# EAGLE design STM32-E407_Rev_A (EAGLE 4.16)
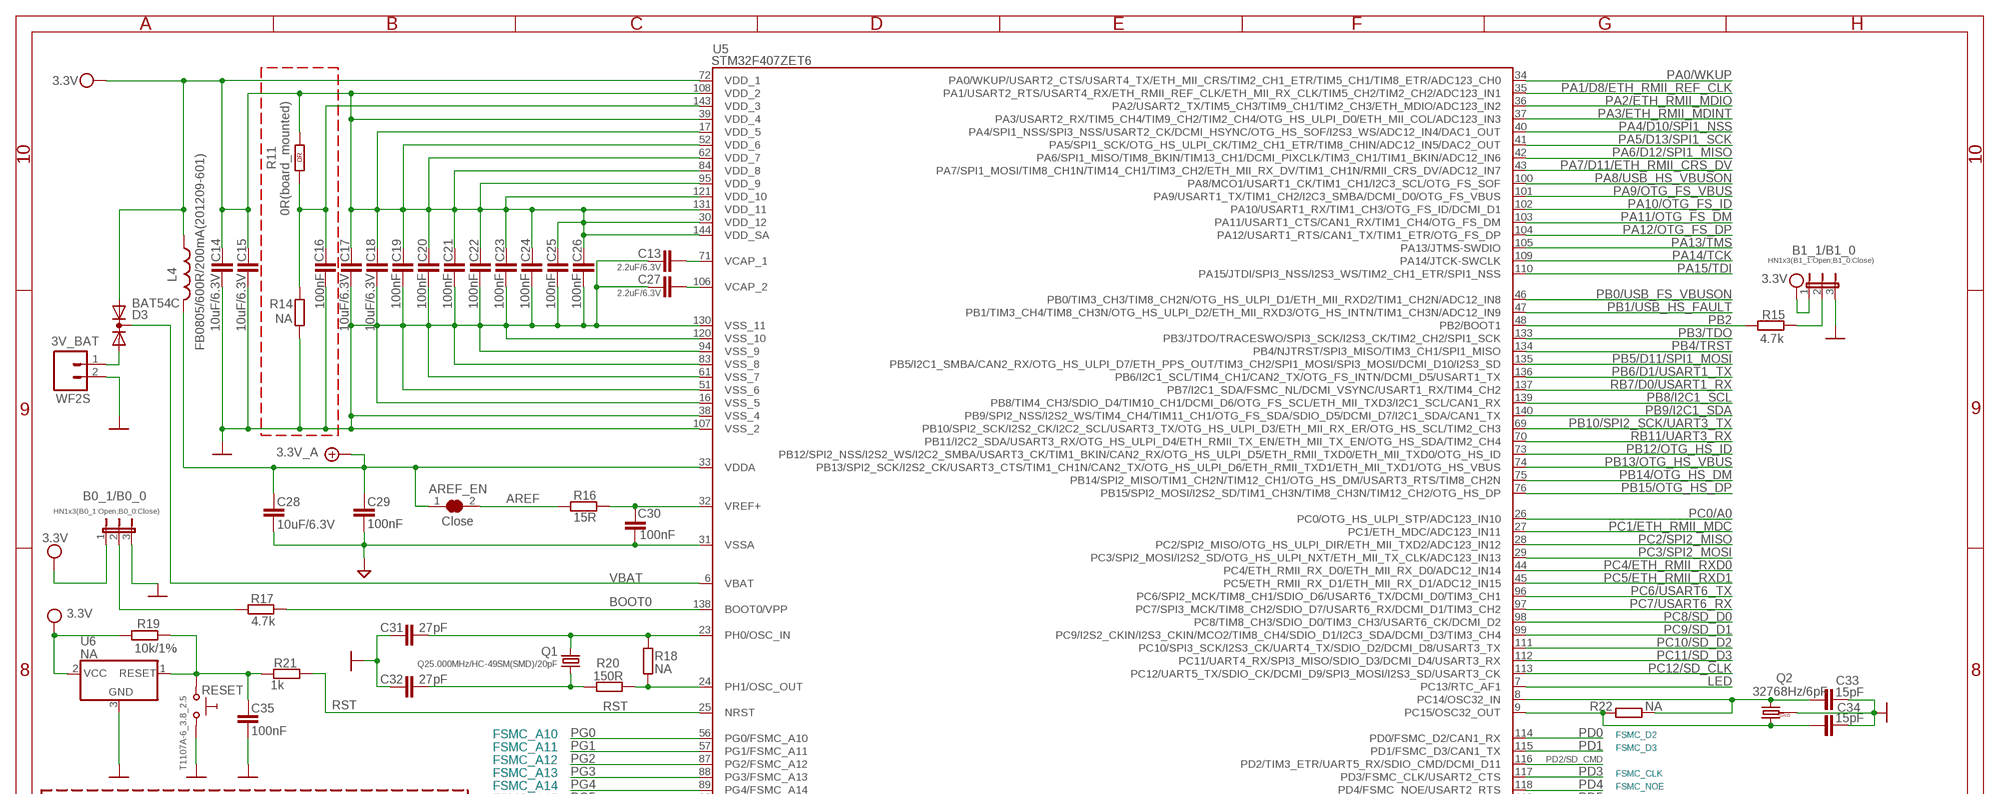
[diagram p0: schematic, sheet 1, part 1 of 2]
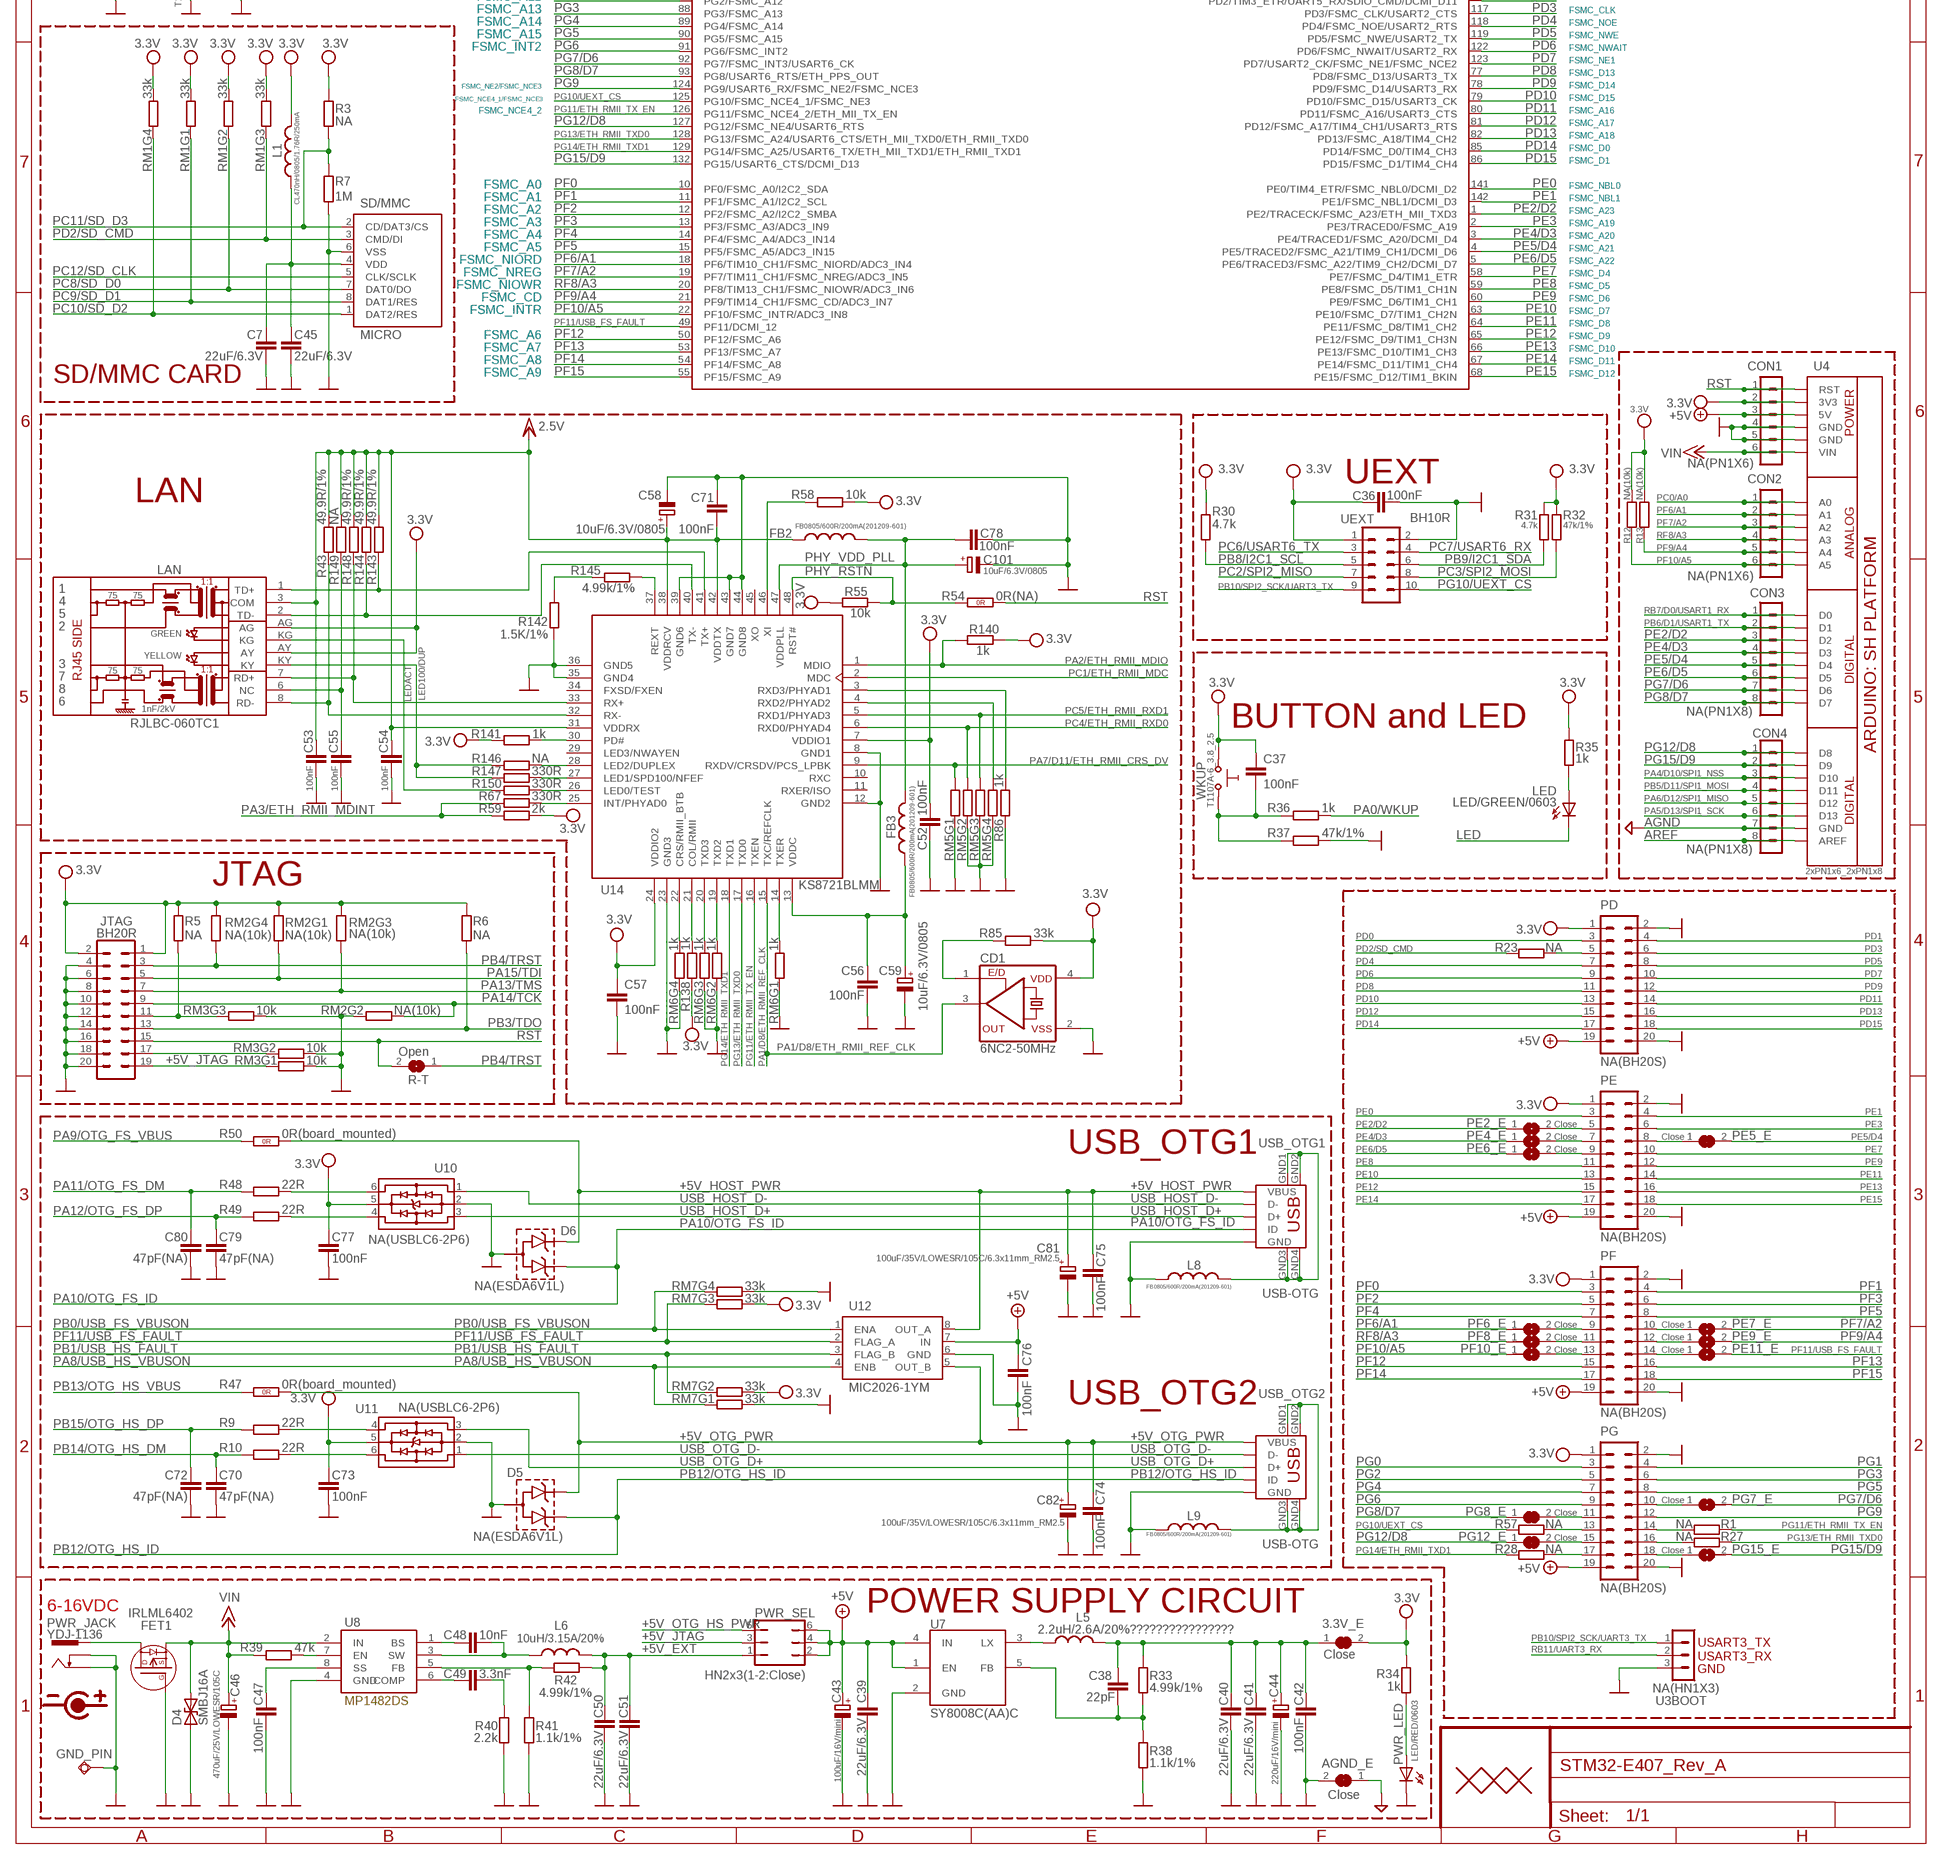
[diagram p1: schematic, sheet 1, part 2 of 2]

## Parts
3.3V_E  Close  SJSJ_1_SMALLER_CLOSE  [SJ_1_SMALLER_CLOSE]
3V_BAT  WF2S  CON2PV2-2.54MM  [CON2.54MM-2-0]
AGND_E  Close  SJSJ_1_SMALLER_CLOSE  [SJ_1_SMALLER_CLOSE]
AREF_EN  Close  SJSJ_1_SMALLER_CLOSE  [SJ_1_SMALLER_CLOSE]
B0_1/B0_0  HN1x3(B0_1:Open;B0_0:Close)  JP2E  [JP2]
B1_1/B1_0  HN1x3(B1_1:Open;B1_0:Close)  JP2E  [JP2]
C7  22uF/6.3V  C-EUC0805_5MIL_DWS  [C0805_5MIL_DWS]
C13  2.2uF/6.3V  C-EUC0603_DWS  [C0603_DWS]
C14  10uF/6.3V  C-EUC0603_DWS  [C0603_DWS]
C15  10uF/6.3V  C-EUC0603_DWS  [C0603_DWS]
C16  100nF  C-EUC0603_DWS  [C0603_DWS]
C17  10uF/6.3V  C-EUC0603_DWS  [C0603_DWS]
C18  10uF/6.3V  C-EUC0603_DWS  [C0603_DWS]
C19  100nF  C-EUC0603_DWS  [C0603_DWS]
C20  100nF  C-EUC0603_DWS  [C0603_DWS]
C21  100nF  C-EUC0603_DWS  [C0603_DWS]
C22  100nF  C-EUC0603_DWS  [C0603_DWS]
C23  100nF  C-EUC0603_DWS  [C0603_DWS]
C24  100nF  C-EUC0603_DWS  [C0603_DWS]
C25  100nF  C-EUC0603_DWS  [C0603_DWS]
C26  100nF  C-EUC0603_DWS  [C0603_DWS]
C27  2.2uF/6.3V  C-EUC0603_DWS  [C0603_DWS]
C28  10uF/6.3V  C-EUC0603_DWS  [C0603_DWS]
C29  100nF  C-EUC0603_DWS  [C0603_DWS]
C30  100nF  C-EUC0603_DWS  [C0603_DWS]
C31  27pF  C-EUC0603_DWS  [C0603_DWS]
C32  27pF  C-EUC0603_DWS  [C0603_DWS]
C33  15pF  C-EUC0603_DWS  [C0603_DWS]
C34  15pF  C-EUC0603_DWS  [C0603_DWS]
C35  100nF  C-EUC0603_DWS  [C0603_DWS]
C36  100nF  C-EUC0603_DWS  [C0603_DWS]
C37  100nF  C-EUC0603_DWS  [C0603_DWS]
C38  22pF  C-EUC0603_DWS  [C0603_DWS]
C39  22uF/6.3V  C-EUC0805_5MIL_DWS  [C0805_5MIL_DWS]
C40  22uF/6.3V  C-EUC0805_5MIL_DWS  [C0805_5MIL_DWS]
C41  22uF/6.3V  C-EUC0805_5MIL_DWS  [C0805_5MIL_DWS]
C42  100nF  C-EUC0603_DWS  [C0603_DWS]
C43  100uF/16V/mini  CPOL-EUE2.5-6  [E2,5-6]
C44  220uF/16V/mini  CPOL-EUE3.5-8  [E3,5-8]
C45  22uF/6.3V  C-EUC0805_5MIL_DWS  [C0805_5MIL_DWS]
C46  470uF/25V/LOWESR/105C  CPOL-EUE5-10.5  [E5-10,5]
C47  100nF  C-EUC0603_DWS  [C0603_DWS]
C48  10nF  C-EUC0603_DWS  [C0603_DWS]
C49  3.3nF  C-EUC0603_DWS  [C0603_DWS]
C50  22uF/6.3V  C-EUC0805_5MIL_DWS  [C0805_5MIL_DWS]
C51  22uF/6.3V  C-EUC0805_5MIL_DWS  [C0805_5MIL_DWS]
C52  100nF  C-EUC0603_DWS  [C0603_DWS]
C53  100nF  C-EUC0603_DWS  [C0603_DWS]
C54  100nF  C-EUC0603_DWS  [C0603_DWS]
C55  100nF  C-EUC0603_DWS  [C0603_DWS]
C56  100nF  C-EUC0603_DWS  [C0603_DWS]
C57  100nF  C-EUC0603_DWS  [C0603_DWS]
C58  10uF/6.3V/0805  CPOL-EUC0805_5MIL_DWS  [C0805_5MIL_DWS]
C59  10uF/6.3V/0805  CPOL-EUC0805_5MIL_DWS  [C0805_5MIL_DWS]
C70  47pF(NA)  C-EUC0603_DWS  [C0603_DWS]
C71  100nF  C-EUC0603_DWS  [C0603_DWS]
C72  47pF(NA)  C-EUC0603_DWS  [C0603_DWS]
C73  100nF  C-EUC0603_DWS  [C0603_DWS]
C74  100nF  C-EUC0603_DWS  [C0603_DWS]
C75  100nF  C-EUC0603_DWS  [C0603_DWS]
C76  100nF  C-EUC0603_DWS  [C0603_DWS]
C77  100nF  C-EUC0603_DWS  [C0603_DWS]
C78  100nF  C-EUC0603_DWS  [C0603_DWS]
C79  47pF(NA)  C-EUC0603_DWS  [C0603_DWS]
C80  47pF(NA)  C-EUC0603_DWS  [C0603_DWS]
C81  100uF/35V/LOWESR/105C/6.3x11mm_RM2.5  CPOL-EUE2.5-6.3  [E2,5-6,3]
C82  100uF/35V/LOWESR/105C/6.3x11mm_RM2.5  CPOL-EUE2.5-6.3  [E2,5-6,3]
C101  10uF/6.3V/0805  CPOL-EUC0805_5MIL_DWS  [C0805_5MIL_DWS]
CD1  6NC2-50MHz  6NC2_CLOCK_DRIVER  [7X5MM_CLOCK_DRIVER]
CON1  NA(PN1X6)  CON6PN1X6  [PN1X6]
CON2  NA(PN1X6)  CON6PN1X6  [PN1X6]
CON3  NA(PN1X8)  CON8PN1X8  [PN1X8]
CON4  NA(PN1X8)  CON8PN1X8  [PN1X8]
D3  BAT54C  DIODE_AC-CA_  [SOT23C]
D4  SMBJ16A  SMBJ15A  [DO214AA]
D5  NA(ESDA6V1L)  MMBZ5V6ALT1  [SOT-23]
D6  NA(ESDA6V1L)  MMBZ5V6ALT1  [SOT-23]
FB2  FB0805/600R/200mA(201209-601)  L-USL0805_5MIL_DWS  [L0805_5MIL_DWS]
FB3  FB0805/600R/200mA(201209-601)  L-USL0805_5MIL_DWS  [L0805_5MIL_DWS]
FET1  IRLML6402  P-MOS+DIODIRLML6402  [SOT23]
GND_PIN  TESTPAD3  [TEST_PAD40/70/SQUARE]
JTAG  BH20R  ML20R  [BH20R]
L1  CL470nH/0805/1.76R/250mA  L-USL0805_5MIL_DWS  [L0805_5MIL_DWS]
L4  FB0805/600R/200mA(201209-601)  L-USL0805_5MIL_DWS  [L0805_5MIL_DWS]
L5  2.2uH/2.6A/20%????????????????  LMCSD75-100KU  [SD75]
L6  10uH/3.15A/20%  LLQH88PN100M38  [8X8MM_3131]
L8  FB0805/600R/200mA(201209-601)  L-USL0805_5MIL_DWS  [L0805_5MIL_DWS]
L9  FB0805/600R/200mA(201209-601)  L-USL0805_5MIL_DWS  [L0805_5MIL_DWS]
LAN  RJLBC-060TC1  [RJLBC-060TC1]
LED  LED/GREEN/0603  LED0603DWS  [LED-0603]
PD  NA(BH20S)  ML20  [ML20-MALE]
PE  NA(BH20S)  ML20  [ML20-MALE]
PE2_E  Close  SJSJ_1_SMALLER_CLOSE  [SJ_1_SMALLER_CLOSE]
PE4_E  Close  SJSJ_1_SMALLER_CLOSE  [SJ_1_SMALLER_CLOSE]
PE5_E  Close  SJSJ_1_SMALLER_CLOSE  [SJ_1_SMALLER_CLOSE]
PE6_E  Close  SJSJ_1_SMALLER_CLOSE  [SJ_1_SMALLER_CLOSE]
PE7_E  Close  SJSJ_1_SMALLER_CLOSE  [SJ_1_SMALLER_CLOSE]
PE9_E  Close  SJSJ_1_SMALLER_CLOSE  [SJ_1_SMALLER_CLOSE]
PE11_E  Close  SJSJ_1_SMALLER_CLOSE  [SJ_1_SMALLER_CLOSE]
PF  NA(BH20S)  ML20  [ML20-MALE]
PF6_E  Close  SJSJ_1_SMALLER_CLOSE  [SJ_1_SMALLER_CLOSE]
PF8_E  Close  SJSJ_1_SMALLER_CLOSE  [SJ_1_SMALLER_CLOSE]
PF10_E  Close  SJSJ_1_SMALLER_CLOSE  [SJ_1_SMALLER_CLOSE]
PG  NA(BH20S)  ML20  [ML20-MALE]
PG7_E  Close  SJSJ_1_SMALLER_CLOSE  [SJ_1_SMALLER_CLOSE]
PG8_E  Close  SJSJ_1_SMALLER_CLOSE  [SJ_1_SMALLER_CLOSE]
PG12_E  Close  SJSJ_1_SMALLER_CLOSE  [SJ_1_SMALLER_CLOSE]
PG15_E  Close  SJSJ_1_SMALLER_CLOSE  [SJ_1_SMALLER_CLOSE]
PWR_JACK  YDJ-1136  PWR-JAKPWR_JACK_UNI_MILLING  [PWR_JACK_UNI_MILLING]
PWR_LED  LED/RED/0603  LED0603DWS  [LED-0603]
PWR_SEL  HN2x3(1-2:Close)  JP3QNEW  [JP3Q_NEW]
Q1  Q25.000MHz/HC-49SM(SMD)/20pF  HC49/S1  [HC49/SMD2_THIN]
Q2  32768Hz/6pF  Q_GND1  [TC26H_3_REPAIR_SMD]
R1  NA  R-EU_R0603_5MIL_DWS  [R0603_5MIL_DWS]
R3  NA  R-EU_R0603_5MIL_DWS_NA  [R0603_5MIL_DWS_NA]
R5  NA  R-EU_R0603_5MIL_DWS_NA  [R0603_5MIL_DWS_NA]
R6  NA  R-EU_R0603_5MIL_DWS_NA  [R0603_5MIL_DWS_NA]
R7  1M  R-EU_R0603_5MIL_DWS  [R0603_5MIL_DWS]
R9  22R  R-EU_R0603_5MIL_DWS  [R0603_5MIL_DWS]
R10  22R  R-EU_R0603_5MIL_DWS  [R0603_5MIL_DWS]
R11  0R(board_mounted)  R_0R0R(NA)  [0603_0R]
R12  NA(10k)  R-EU_R0603_5MIL_DWS_NA  [R0603_5MIL_DWS_NA]
R13  NA(10k)  R-EU_R0603_5MIL_DWS_NA  [R0603_5MIL_DWS_NA]
R14  NA  R-EU_R0603_5MIL_DWS_NA  [R0603_5MIL_DWS_NA]
R15  4.7k  R-EU_R0603_5MIL_DWS  [R0603_5MIL_DWS]
R16  15R  R-EU_R0603_5MIL_DWS  [R0603_5MIL_DWS]
R17  4.7k  R-EU_R0603_5MIL_DWS  [R0603_5MIL_DWS]
R18  NA  R-EU_R0603_5MIL_DWS_NA  [R0603_5MIL_DWS_NA]
R19  10k/1%  R-EU_R0603_5MIL_DWS  [R0603_5MIL_DWS]
R20  150R  R-EU_R0603_5MIL_DWS  [R0603_5MIL_DWS]
R21  1k  R-EU_R0603_5MIL_DWS  [R0603_5MIL_DWS]
R22  NA  R-EU_R0603_5MIL_DWS_NA  [R0603_5MIL_DWS_NA]
R23  NA  R-EU_R0603_5MIL_DWS  [R0603_5MIL_DWS]
R27  NA  R-EU_R0603_5MIL_DWS  [R0603_5MIL_DWS]
R28  NA  R-EU_R0603_5MIL_DWS  [R0603_5MIL_DWS]
R30  4.7k  R-EU_R0603_5MIL_DWS  [R0603_5MIL_DWS]
R31  4.7k  R-EU_R0603_5MIL_DWS  [R0603_5MIL_DWS]
R32  47k/1%  R-EU_R0603_5MIL_DWS  [R0603_5MIL_DWS]
R33  4.99k/1%  R-EU_R0603_5MIL_DWS  [R0603_5MIL_DWS]
R34  1k  R-EU_R0603_5MIL_DWS  [R0603_5MIL_DWS]
R35  1k  R-EU_R0603_5MIL_DWS  [R0603_5MIL_DWS]
R36  1k  R-EU_R0603_5MIL_DWS  [R0603_5MIL_DWS]
R37  47k/1%  R-EU_R0603_5MIL_DWS  [R0603_5MIL_DWS]
R38  1.1k/1%  R-EU_R0603_5MIL_DWS  [R0603_5MIL_DWS]
R39  47k  R-EU_R0603_5MIL_DWS  [R0603_5MIL_DWS]
R40  2.2k  R-EU_R0603_5MIL_DWS  [R0603_5MIL_DWS]
R41  1.1k/1%  R-EU_R0603_5MIL_DWS  [R0603_5MIL_DWS]
R42  4.99k/1%  R-EU_R0603_5MIL_DWS  [R0603_5MIL_DWS]
R43  49.9R/1%  R-EU_R0603_5MIL_DWS  [R0603_5MIL_DWS]
R47  0R(board_mounted)  R_0R0R(NA)  [0603_0R]
R48  22R  R-EU_R0603_5MIL_DWS  [R0603_5MIL_DWS]
R49  22R  R-EU_R0603_5MIL_DWS  [R0603_5MIL_DWS]
R50  0R(board_mounted)  R_0R0R(NA)  [0603_0R]
R54  0R(NA)  R_0R0R(NA)  [0603_0R]
R55  10k  R-EU_R0603_5MIL_DWS  [R0603_5MIL_DWS]
R57  NA  R-EU_R0603_5MIL_DWS  [R0603_5MIL_DWS]
R58  10k  R-EU_R0603_5MIL_DWS  [R0603_5MIL_DWS]
R59  2k  R-EU_R0603_5MIL_DWS  [R0603_5MIL_DWS]
R67  330R  R-EU_R0603_5MIL_DWS  [R0603_5MIL_DWS]
R85  33k  R-EU_R0603_5MIL_DWS  [R0603_5MIL_DWS]
R86  1k  R-EU_R0603_5MIL_DWS  [R0603_5MIL_DWS]
R138  1k  R-EU_R0603_5MIL_DWS  [R0603_5MIL_DWS]
R140  1k  R-EU_R0603_5MIL_DWS  [R0603_5MIL_DWS]
R141  1k  R-EU_R0603_5MIL_DWS  [R0603_5MIL_DWS]
R142  1.5K/1%  R-EU_R0603_5MIL_DWS  [R0603_5MIL_DWS]
R143  49.9R/1%  R-EU_R0603_5MIL_DWS  [R0603_5MIL_DWS]
R144  49.9R/1%  R-EU_R0603_5MIL_DWS  [R0603_5MIL_DWS]
R145  4.99k/1%  R-EU_R0603_5MIL_DWS  [R0603_5MIL_DWS]
R146  NA  R-EU_R0603_5MIL_DWS_NA  [R0603_5MIL_DWS_NA]
R147  330R  R-EU_R0603_5MIL_DWS  [R0603_5MIL_DWS]
R148  49.9R/1%  R-EU_R0603_5MIL_DWS  [R0603_5MIL_DWS]
R149  NA  R-EU_R0603_5MIL_DWS_NA  [R0603_5MIL_DWS_NA]
R150  330R  R-EU_R0603_5MIL_DWS  [R0603_5MIL_DWS]
R-T  Open  SJSJ_SMALLER  [SJ_1_SMALLER]
RESET  T1107A-6_3.8_2.5  SW-TAKT6  [SW-TAKT_6X3.5_SMD]
RM1  33k  R_MATRIX_4E  [R_MATRIX_4]
RM2  NA(10k)  R_MATRIX_4E  [R_MATRIX_4]
RM3  10k  R_MATRIX_4E  [R_MATRIX_4]
RM5  R_MATRIX_4E  [R_MATRIX_4]
RM6  1k  R_MATRIX_4E  [R_MATRIX_4]
RM7  33k  R_MATRIX_4E  [R_MATRIX_4]
SD/MMC  MICRO  MICRO_SD/MMC  [TFR-MEM-CON]
U3BOOT  NA(HN1X3)  CON3HN1X3  [HN1X3]
U4  2xPN1x6_2xPN1x8  ARDUINO_SH_PLATFORM3  [ARDUINO_SHIELD_PLATFORM_WITHOUT_DIMENSION]
U5  STM32F407ZET6  STM32F207ZET6  [LQFP144]
U6  NA  RESETMCP130T-300-I/TT  [SOT23]
U7  SY8008C(AA)C  SY8008  [SOT23-5]
U8  MP1482DS  MP1482  [SOIC8]
U10  NA(USBLC6-2P6)  USBLC6-2  [USBLC6-2P6]
U11  NA(USBLC6-2P6)  USBLC6-2  [USBLC6-2P6]
U12  MIC2026-1YM  [SO-8]
U14  KS8721BLMM  [LQFP48_MM]
U$1  FIDUCIAL1X2  [FIDUCIAL-1X2]
U$2  FIDUCIAL1X2  [FIDUCIAL-1X2]
U$9  FIDUCIAL1X2  [FIDUCIAL-1X2]
UEXT  BH10R  ML10R  [BH10R]
USB_OTG1  USB-OTG  MINI_USB9  [USB_MINI_9PIN]
USB_OTG2  USB-OTG  MINI_USB9  [USB_MINI_9PIN]
WKUP  T1107A-6_3.8_2.5  SW-TAKT6  [SW-TAKT_6X3.5_SMD]

## Nets
+5V: C39.1 C43.+ C76.1 CON1.3 PD.19 PE.19 PF.19 PG.19 PWR_SEL.2 PWR_SEL.4 PWR_SEL.6 U4.5V U7.1(EN) U7.4(IN) U12.7(IN)
+5V_EXT: C50.1 C51.1 L6.2 PWR_SEL.1 R42.2
+5V_HOST_PWR: C75.1 C81.+ D6.1 R50.2(1.2) U12.8(OUT_A) USB_OTG1.VBUS
+5V_JTAG: JTAG.19 PWR_SEL.3 RM3.1.1
+5V_OTG_HS_PWR: PWR_SEL.5
+5V_OTG_PWR: C74.1 C82.+ D5.1 R47.2(1.2) U12.5(OUT_B) USB_OTG2.VBUS
+7V: AREF_EN.1 C28.1 C29.2 L4.2 U5.33(VDDA) ; supply symbol labelled 3.3V_A
+15V: C46.+ CON1.6 D4.C FET1.2(S) R39.1 U4.VIN U8.2(IN) ; supply symbol labelled VIN
AGND: AGND_E.1 C28.2 C29.1 C30.1 CON4.7 U4.GND@2(GND) U5.31(VSSA)
AREF: AREF_EN.2 CON4.8 R16.1 U4.AREF
BOOT0: R17.1 U5.138(BOOT0/VPP)
GND [PWR]: 3V_BAT.2 AGND_E.2 B0_1/B0_0.3 B1_1/B1_0.3 C7.2 C13.1 C14.1 C15.1 C16.1 C17.1 C18.1 C19.1 C20.1 C21.1 C22.1 C23.1 C24.1 C25.1 C26.1 C27.1 C31.2 C32.2 C33.2 C34.2 C35.1 C36.1 C39.2 C40.2 C41.2 C42.2 C43.- C44.- C45.2 C46.- C47.2 C50.2 C51.2 C52.2 C53.2 C54.2 C55.1 C56.2 C57.2 C58.2(-) C59.2(-) C70.2 C71.1 C72.2 C73.1 C74.2 C75.2 C76.2 C77.1 C78.2 C79.2 C80.2 C81.- C82.- C101.2(-) CD1.2(VSS) CON1.4 CON1.5 D4.A D5.3 D6.3 FET1.1(G) GND_PIN.P$1(PP) JTAG.4 JTAG.6 JTAG.8 JTAG.10 JTAG.12 JTAG.14 JTAG.16 JTAG.18 JTAG.20 L8.1 L9.1 PD.2 PD.20 PE.2 PE.20 PF.2 PF.20 PG.2 PG.20 PWR_JACK.- PWR_JACK.-- PWR_LED.C Q2.GND R7.2 R14.2 R37.1 R38.2 R40.2 R41.2 R86.2 R142.2 RESET.P$2 RM2.2.1 RM3.1.2 RM3.2.2 RM3.3.2 RM5.1.1 RM5.2.1 RM5.3.1 RM5.4.1 RM6.1.1 RM6.2.1 RM6.3.1 RM6.4.1 RM7.1.2 RM7.4.2 SD/MMC.6(VSS) U3BOOT.3 U4.GND U4.GND@1(GND) U5.16(VSS_5) U5.38(VSS_4) U5.51(VSS_6) U5.61(VSS_7) U5.83(VSS_8) U5.94(VSS_9) U5.107(VSS_2) U5.120(VSS_10) U5.130(VSS_11) U6.3(GND) U7.2(GND) U8.4(GND) U10.2 U11.2 U12.6(GND) U14.8(GND1) U14.12(GND2) U14.23(GND3) U14.35(GND4) U14.36(GND5) U14.39(GND6) U14.43(GND7) U14.44(GND8) UEXT.2 USB_OTG1.GND USB_OTG2.GND
LED: LED.C U5.7(PC13/RTC_AF1)
LED100/DUP: LAN.KY R146.1 R147.1
LEDACT: LAN.KG R150.1
N$1: C31.1 Q1.2 R18.2 U5.23(PH0/OSC_IN)
N$2: C32.1 Q1.1 R20.1
N$3: R18.1 R20.2 U5.24(PH1/OSC_OUT)
N$4: JTAG.17 RM3.2.1
N$5: LED.A R35.1
N$6: PD.5 R23.1
N$7: R142.1 R145.1
N$8: C38.2 R33.2 R38.1 U7.5(FB)
N$9: B0_1/B0_0.2 R17.2
N$10 [PWR]: 3.3V_E.1 C38.1 C40.1 C41.1 C42.1 C44.+ L5.2 R33.1
N$11: C56.1 C59.1(+) FB3.2 U14.13(VDDC)
N$12: PG.14 R1.2
N$13: PF10_E.2 PF.13
N$14: PG.16 R27.2
N$15: PF6_E.2 PF.9
N$16: PF8_E.2 PF.11
N$17: PE7_E.1 PF.10
N$18: PG.17 R28.1
N$19: PE9_E.1 PF.12
N$21: LAN.2(TD-) R144.1 U14.40(TX-)
N$22: LAN.1(TD+) R143.1 U14.41(TX+)
N$24: PG7_E.1 PG.10
N$25: C37.1 R36.1 R37.2 WKUP.P$2
N$26: PE5_E.1 PE.8
N$27: PE6_E.2 PE.9
N$28: PE4_E.2 PE.7
N$29: B1_1/B1_0.2 R15.2
N$30: PE2_E.2 PE.5
N$31: FET1.3(D) PWR_JACK.+
N$32: PG8_E.2 PG.11
N$33: LAN.7(RD+) R148.1 U14.33(RX+)
N$34: PG12_E.2 PG.15
N$35: PG15_E.1 PG.18
N$36: C47.1 U8.8(SS)
N$37: R39.2 U8.7(EN)
N$38: PG.13 R57.1
N$39: PE11_E.1 PF.14
N$40: R147.2 U14.27(LED1/SPD100/NFEF)
N$43: R9.2 U11.4
N$45: R150.2 U14.26(LED0/TEST)
N$46: C48.1 U8.1(BS)
N$47: R10.2 U11.6
N$48: R141.2 U14.30(PD#)
N$50: C48.2 L6.1 U8.3(SW)
N$51: R48.2 U10.6
N$52: R49.2 U10.4
N$60: C49.1 U8.6(COMP)
N$61: C49.2 R40.1
N$62: R41.1 R42.1 U8.5(FB)
N$64: L5.1 U7.3(LX)
N$68: R146.2 U14.28(LED2/DUPLEX)
N$71: R145.2 U14.37(REXT)
N$75: 3V_BAT.1 D3.2(A2)
N$78: C7.1 C45.1 L1.2 SD/MMC.4(VDD)
N$79: C55.2 LAN.6(NC) R149.1
N$82: LAN.8(RD-) R43.1 U14.32(RX-)
N$85: JTAG.11 R5.1 RM3.3.1
N$98: R138.1 U14.21(COL/RMII)
N$114: RM6.4.2 U14.22(CRS/RMII_BTB)
N$115: RM5.4.2 U14.4(RXD2/PHYAD2)
N$116: R86.1 U14.3(RXD3/PHYAD1)
N$117: C13.2 U5.71(VCAP_1)
N$119: CD1.1(E/D) R85.2
N$120: RM6.1.2 U14.14(TXER)
N$121: R67.2 U14.25(INT/PHYAD0)
N$122: R58.2 U14.46(XI)
N$123: RM6.2.2 U14.19(TXD2)
N$125: RM6.3.2 U14.20(TXD3)
N$128: C27.2 U5.106(VCAP_2)
N$129: PWR_LED.A R34.2
N$163: C35.2 R19.1 R21.2 RESET.P$1 U6.1(RESET)
N$470: C16.2 R11.1(1.1) R14.1 U5.143(VDD_3)
PA0/WKUP: R36.2 U5.34(PA0/WKUP/USART2_CTS/USART4_TX/ETH_MII_CRS/TIM2_CH1_ETR/TIM5_CH1/TIM8_ETR/ADC123_CH0)
PA1/D8/ETH_RMII_REF_CLK: CD1.3(OUT) U5.35(PA1/USART2_RTS/USART4_RX/ETH_RMII_REF_CLK/ETH_MII_RX_CLK/TIM5_CH2/TIM2_CH2/ADC123_IN1) U14.15(TXC/REFCLK)
PA2/ETH_RMII_MDIO [thin]: R140.2 U5.36(PA2/USART2_TX/TIM5_CH3/TIM9_CH1/TIM2_CH3/ETH_MDIO/ADC123_IN2) U14.1(MDIO)
PA3/ETH_RMII_MDINT: R59.1 R67.1 U5.37(PA3/USART2_RX/TIM5_CH4/TIM9_CH2/TIM2_CH4/OTG_HS_ULPI_D0/ETH_MII_COL/ADC123_IN3)
PA4/D10/SPI1_NSS: CON4.3 U4.D10 U5.40(PA4/SPI1_NSS/SPI3_NSS/USART2_CK/DCMI_HSYNC/OTG_HS_SOF/I2S3_WS/ADC12_IN4/DAC1_OUT)
PA5/D13/SPI1_SCK: CON4.6 U4.D13 U5.41(PA5/SPI1_SCK/OTG_HS_ULPI_CK/TIM2_CH1_ETR/TIM8_CHIN/ADC12_IN5/DAC2_OUT)
PA6/D12/SPI1_MISO: CON4.5 U4.D12 U5.42(PA6/SPI1_MISO/TIM8_BKIN/TIM13_CH1/DCMI_PIXCLK/TIM3_CH1/TIM1_BKIN/ADC12_IN6)
PA7/D11/ETH_RMII_CRS_DV: RM5.1.2 U5.43(PA7/SPI1_MOSI/TIM8_CH1N/TIM14_CH1/TIM3_CH2/ETH_MII_RX_DV/TIM1_CH1N/RMII_CRS_DV/ADC12_IN7) U14.9(RXDV/CRSDV/PCS_LPBK)
PA8/USB_HS_VBUSON: RM7.1.1 U5.100(PA8/MCO1/USART1_CK/TIM1_CH1/I2C3_SCL/OTG_FS_SOF) U12.4(ENB)
PA9/OTG_FS_VBUS: R50.1(1.1) U5.101(PA9/USART1_TX/TIM1_CH2/I2C3_SMBA/DCMI_D0/OTG_FS_VBUS)
PA10/OTG_FS_ID: D6.2 U5.102(PA10/USART1_RX/TIM1_CH3/OTG_FS_ID/DCMI_D1) USB_OTG1.ID
PA11/OTG_FS_DM: C80.1 R48.1 U5.103(PA11/USART1_CTS/CAN1_RX/TIM1_CH4/OTG_FS_DM)
PA12/OTG_FS_DP: C79.1 R49.1 U5.104(PA12/USART1_RTS/CAN1_TX/TIM1_ETR/OTG_FS_DP)
PA13/TMS: JTAG.7 RM2.3.1 U5.105(PA13/JTMS-SWDIO)
PA14/TCK: JTAG.9 RM2.2.2 U5.109(PA14/JTCK-SWCLK)
PA15/TDI: JTAG.5 RM2.1.1 U5.110(PA15/JTDI/SPI3_NSS/I2S3_WS/TIM2_CH1_ETR/SPI1_NSS)
PB0/USB_FS_VBUSON: RM7.4.1 U5.46(PB0/TIM3_CH3/TIM8_CH2N/OTG_HS_ULPI_D1/ETH_MII_RXD2/TIM1_CH2N/ADC12_IN8) U12.1(ENA)
PB1/USB_HS_FAULT: RM7.2.1 U5.47(PB1/TIM3_CH4/TIM8_CH3N/OTG_HS_ULPI_D2/ETH_MII_RXD3/OTG_HS_INTN/TIM1_CH3N/ADC12_IN9) U12.3(FLAG_B)
PB2: R15.1 U5.48(PB2/BOOT1)
PB3/TDO: JTAG.13 R6.1 U5.133(PB3/JTDO/TRACESWO/SPI3_SCK/I2S3_CK/TIM2_CH2/SPI1_SCK)
PB4/TRST: JTAG.3 R-T.1 RM2.4.1 U5.134(PB4/NJTRST/SPI3_MISO/TIM3_CH1/SPI1_MISO)
PB5/D11/SPI1_MOSI: CON4.4 U4.D11 U5.135(PB5/I2C1_SMBA/CAN2_RX/OTG_HS_ULPI_D7/ETH_PPS_OUT/TIM3_CH2/SPI1_MOSI/SPI3_MOSI/DCMI_D10/I2S3_SD)
PB6/D1/USART1_TX: CON3.2 U4.D1 U5.136(PB6/I2C1_SCL/TIM4_CH1/CAN2_TX/OTG_FS_INTN/DCMI_D5/USART1_TX)
PB8/I2C1_SCL: R30.1 U5.139(PB8/TIM4_CH3/SDIO_D4/TIM10_CH1/DCMI_D6/OTG_FS_SCL/ETH_MII_TXD3/I2C1_SCL/CAN1_RX) UEXT.5
PB9/I2C1_SDA: R31.1 U5.140(PB9/SPI2_NSS/I2S2_WS/TIM4_CH4/TIM11_CH1/OTG_FS_SDA/SDIO_D5/DCMI_D7/I2C1_SDA/CAN1_TX) UEXT.6
PB10/SPI2_SCK/UART3_TX: U3BOOT.1 U5.69(PB10/SPI2_SCK/I2S2_CK/I2C2_SCL/USART3_TX/OTG_HS_ULPI_D3/ETH_MII_RX_ER/OTG_HS_SCL/TIM2_CH3) UEXT.9
PB12/OTG_HS_ID: D5.2 U5.73(PB12/SPI2_NSS/I2S2_WS/I2C2_SMBA/USART3_CK/TIM1_BKIN/CAN2_RX/OTG_HS_ULPI_D5/ETH_RMII_TXD0/ETH_MII_TXD0/OTG_HS_ID) USB_OTG2.ID
PB13/OTG_HS_VBUS: R47.1(1.1) U5.74(PB13/SPI2_SCK/I2S2_CK/USART3_CTS/TIM1_CH1N/CAN2_TX/OTG_HS_ULPI_D6/ETH_RMII_TXD1/ETH_MII_TXD1/OTG_HS_VBUS)
PB14/OTG_HS_DM: C70.1 R10.1 U5.75(PB14/SPI2_MISO/TIM1_CH2N/TIM12_CH1/OTG_HS_DM/USART3_RTS/TIM8_CH2N)
PB15/OTG_HS_DP: C72.1 R9.1 U5.76(PB15/SPI2_MOSI/I2S2_SD/TIM1_CH3N/TIM8_CH3N/TIM12_CH2/OTG_HS_DP)
PC0/A0: CON2.1 U4.A0 U5.26(PC0/OTG_HS_ULPI_STP/ADC123_IN10)
PC1/ETH_RMII_MDC: U5.27(PC1/ETH_MDC/ADC123_IN11) U14.2(MDC)
PC2/SPI2_MISO: U5.28(PC2/SPI2_MISO/OTG_HS_ULPI_DIR/ETH_MII_TXD2/ADC123_IN12) UEXT.7
PC3/SPI2_MOSI: R32.1 U5.29(PC3/SPI2_MOSI/I2S2_SD/OTG_HS_ULPI_NXT/ETH_MII_TX_CLK/ADC123_IN13) UEXT.8
PC4/ETH_RMII_RXD0: RM5.2.2 U5.44(PC4/ETH_RMII_RX_D0/ETH_MII_RX_D0/ADC12_IN14) U14.6(RXD0/PHYAD4)
PC5/ETH_RMII_RXD1: RM5.3.2 U5.45(PC5/ETH_RMII_RX_D1/ETH_MII_RX_D1/ADC12_IN15) U14.5(RXD1/PHYAD3)
PC6/USART6_TX: U5.96(PC6/SPI2_MCK/TIM8_CH1/SDIO_D6/USART6_TX/DCMI_D0/TIM3_CH1) UEXT.3
PC7/USART6_RX: U5.97(PC7/SPI3_MCK/TIM8_CH2/SDIO_D7/USART6_RX/DCMI_D1/TIM3_CH2) UEXT.4
PC8/SD_D0: RM1.2.1 SD/MMC.7(DAT0/DO) U5.98(PC8/TIM8_CH3/SDIO_D0/TIM3_CH3/USART6_CK/DCMI_D2)
PC9/SD_D1: RM1.1.1 SD/MMC.8(DAT1/RES) U5.99(PC9/I2S2_CKIN/I2S3_CKIN/MCO2/TIM8_CH4/SDIO_D1/I2C3_SDA/DCMI_D3/TIM3_CH4)
PC10/SD_D2: RM1.4.1 SD/MMC.1(DAT2/RES) U5.111(PC10/SPI3_SCK/I2S3_CK/UART4_TX/SDIO_D2/DCMI_D8/USART3_TX)
PC11/SD_D3: R3.2 R7.1 SD/MMC.2(CD/DAT3/CS) U5.112(PC11/UART4_RX/SPI3_MISO/SDIO_D3/DCMI_D4/USART3_RX)
PC12/SD_CLK: SD/MMC.5(CLK/SCLK) U5.113(PC12/UART5_TX/SDIO_CK/DCMI_D9/SPI3_MOSI/I2S3_SD/USART3_CK)
PC14: C33.1 Q2.2 R22.2 U5.8(PC14/OSC32_IN)
PC15: C34.1 Q2.1 R22.1 U5.9(PC15/OSC32_OUT)
PD0: PD.3 U5.114(PD0/FSMC_D2/CAN1_RX)
PD1: PD.4 U5.115(PD1/FSMC_D3/CAN1_TX)
PD2/SD_CMD: R23.2 RM1.3.1 SD/MMC.3(CMD/DI) U5.116(PD2/TIM3_ETR/UART5_RX/SDIO_CMD/DCMI_D11)
PD3: PD.6 U5.117(PD3/FSMC_CLK/USART2_CTS)
PD4: PD.7 U5.118(PD4/FSMC_NOE/USART2_RTS)
PD5: PD.8 U5.119(PD5/FSMC_NWE/USART2_TX)
PD6: PD.9 U5.122(PD6/FSMC_NWAIT/USART2_RX)
PD7: PD.10 U5.123(PD7/USART2_CK/FSMC_NE1/FSMC_NCE2)
PD8 [thin]: PD.11 U5.77(PD8/FSMC_D13/USART3_TX)
PD9: PD.12 U5.78(PD9/FSMC_D14/USART3_RX)
PD10: PD.13 U5.79(PD10/FSMC_D15/USART3_CK)
PD11 [thin]: PD.14 U5.80(PD11/FSMC_A16/USART3_CTS)
PD12 [thin]: PD.15 U5.81(PD12/FSMC_A17/TIM4_CH1/USART3_RTS)
PD13: PD.16 U5.82(PD13/FSMC_A18/TIM4_CH2)
PD14: PD.17 U5.85(PD14/FSMC_D0/TIM4_CH3)
PD15 [thin]: PD.18 U5.86(PD15/FSMC_D1/TIM4_CH4)
PE0: PE.3 U5.141(PE0/TIM4_ETR/FSMC_NBL0/DCMI_D2)
PE1 [thin]: PE.4 U5.142(PE1/FSMC_NBL1/DCMI_D3)
PE2/D2: CON3.3 PE2_E.1 U4.D2 U5.1(PE2/TRACECK/FSMC_A23/ETH_MII_TXD3)
PE3: PE.6 U5.2(PE3/TRACED0/FSMC_A19)
PE4/D3: CON3.4 PE4_E.1 U4.D3 U5.3(PE4/TRACED1/FSMC_A20/DCMI_D4)
PE5/D4: CON3.5 PE5_E.2 U4.D4 U5.4(PE5/TRACED2/FSMC_A21/TIM9_CH1/DCMI_D6)
PE6/D5: CON3.6 PE6_E.1 U4.D5 U5.5(PE6/TRACED3/FSMC_A22/TIM9_CH2/DCMI_D7)
PE7 [thin]: PE.10 U5.58(PE7/FSMC_D4/TIM1_ETR)
PE8 [thin]: PE.11 U5.59(PE8/FSMC_D5/TIM1_CH1N)
PE9: PE.12 U5.60(PE9/FSMC_D6/TIM1_CH1)
PE10: PE.13 U5.63(PE10/FSMC_D7/TIM1_CH2N)
PE11: PE.14 U5.64(PE11/FSMC_D8/TIM1_CH2)
PE12: PE.15 U5.65(PE12/FSMC_D9/TIM1_CH3N)
PE13 [thin]: PE.16 U5.66(PE13/FSMC_D10/TIM1_CH3)
PE14 [thin]: PE.17 U5.67(PE14/FSMC_D11/TIM1_CH4)
PE15 [thin]: PE.18 U5.68(PE15/FSMC_D12/TIM1_BKIN)
PF0: PF.3 U5.10(PF0/FSMC_A0/I2C2_SDA)
PF1: PF.4 U5.11(PF1/FSMC_A1/I2C2_SCL)
PF2: PF.5 U5.12(PF2/FSMC_A2/I2C2_SMBA)
PF3: PF.6 U5.13(PF3/FSMC_A3/ADC3_IN9)
PF4: PF.7 U5.14(PF4/FSMC_A4/ADC3_IN14)
PF5 [thin]: PF.8 U5.15(PF5/FSMC_A5/ADC3_IN15)
PF6/A1: CON2.2 PF6_E.1 U4.A1 U5.18(PF6/TIM10_CH1/FSMC_NIORD/ADC3_IN4)
PF7/A2: CON2.3 PE7_E.2 U4.A2 U5.19(PF7/TIM11_CH1/FSMC_NREG/ADC3_IN5)
PF9/A4: CON2.5 PE9_E.2 R13.1 U4.A4 U5.21(PF9/TIM14_CH1/FSMC_CD/ADC3_IN7)
PF10/A5: CON2.6 PF10_E.1 R12.1 U4.A5 U5.22(PF10/FSMC_INTR/ADC3_IN8)
PF11/USB_FS_FAULT: PE11_E.2 RM7.3.1 U5.49(PF11/DCMI_12) U12.2(FLAG_A)
PF12 [thin]: PF.15 U5.50(PF12/FSMC_A6)
PF13 [thin]: PF.16 U5.53(PF13/FSMC_A7)
PF14 [thin]: PF.17 U5.54(PF14/FSMC_A8)
PF15: PF.18 U5.55(PF15/FSMC_A9)
PG0 [thin]: PG.3 U5.56(PG0/FSMC_A10)
PG1 [thin]: PG.4 U5.57(PG1/FSMC_A11)
PG2: PG.5 U5.87(PG2/FSMC_A12)
PG3: PG.6 U5.88(PG3/FSMC_A13)
PG4 [thin]: PG.7 U5.89(PG4/FSMC_A14)
PG5 [thin]: PG.8 U5.90(PG5/FSMC_A15)
PG6: PG.9 U5.91(PG6/FSMC_INT2)
PG7/D6: CON3.7 PG7_E.2 U4.D6 U5.92(PG7/FSMC_INT3/USART6_CK)
PG8/D7: CON3.8 PG8_E.1 U4.D7 U5.93(PG8/USART6_RTS/ETH_PPS_OUT)
PG9: PG.12 U5.124(PG9/USART6_RX/FSMC_NE2/FSMC_NCE3)
PG10/UEXT_CS: R57.2 U5.125(PG10/FSMC_NCE4_1/FSMC_NE3) UEXT.10
PG11/ETH_RMII_TX_EN: R1.1 U5.126(PG11/FSMC_NCE4_2/ETH_MII_TX_EN) U14.16(TXEN)
PG12/D8: CON4.1 PG12_E.1 U4.D8 U5.127(PG12/FSMC_NE4/USART6_RTS)
PG13/ETH_RMII_TXD0: R27.1 U5.128(PG13/FSMC_A24/USART6_CTS/ETH_MII_TXD0/ETH_RMII_TXD0) U14.17(TXD0)
PG14/ETH_RMII_TXD1: R28.2 U5.129(PG14/FSMC_A25/USART6_TX/ETH_MII_TXD1/ETH_RMII_TXD1) U14.18(TXD1)
PG15/D9: CON4.2 PG15_E.2 U4.D9 U5.132(PG15/USART6_CTS/DCMI_D13)
PHY_RSTN: R54.1(1.1) R55.2 U14.48(RST#)
PHY_VDD_PLL: C78.1 C101.1(+) FB2.1 FB3.1 U14.47(VDDPLL)
RB7/D0/USART1_RX: CON3.1 U4.D0 U5.137(PB7/I2C1_SDA/FSMC_NL/DCMI_VSYNC/USART1_RX/TIM4_CH2)
RB11/UART3_RX: U3BOOT.2 U5.70(PB11/I2C2_SDA/USART3_RX/OTG_HS_ULPI_D4/ETH_RMII_TX_EN/ETH_MII_TX_EN/OTG_HS_SDA/TIM2_CH4)
RF8/A3: CON2.4 PF8_E.1 U4.A3 U5.20(PF8/TIM13_CH1/FSMC_NIOWR/ADC3_IN6)
RST: CON1.1 JTAG.15 R21.1 R54.2(1.2) R-T.2 U4.RST U5.25(NRST)
USB_HOST_D+: U10.3 USB_OTG1.D+
USB_HOST_D-: U10.1 USB_OTG1.D-
USB_OTG_D+: U11.3 USB_OTG2.D+
USB_OTG_D-: U11.1 USB_OTG2.D-
USB_SHIELD1: L9.2 USB_OTG2.GND1 USB_OTG2.GND2 USB_OTG2.GND3 USB_OTG2.GND4
USB_SHIELD2: L8.2 USB_OTG1.GND1 USB_OTG1.GND2 USB_OTG1.GND3 USB_OTG1.GND4
VBAT: D3.3(K) U5.6(VBAT)
VCC [PWR]: 3.3V_E.2 B0_1/B0_0.1 B1_1/B1_0.1 C14.2 C15.2 C17.2 C18.2 C19.2 C20.2 C21.2 C22.2 C23.2 C24.2 C25.2 C26.2 C36.2 C37.2 C52.1 C57.1 C73.2 C77.2 CD1.4(VDD) CON1.2 D3.1(A1) JTAG.1 JTAG.2 L1.1 L4.1 LAN.AG LAN.AY PD.1 PE.1 PF.1 PG.1 R3.1 R5.2 R6.2 R11.2(1.2) R12.2 R13.2 R19.2 R30.2 R31.2 R32.2 R34.1 R35.2 R55.1 R58.1 R59.2 R85.1 R138.2 R140.1 R141.1 RM1.1.2 RM1.2.2 RM1.3.2 RM1.4.2 RM2.1.2 RM2.3.2 RM2.4.2 RM7.2.2 RM7.3.2 U4.3V3 U5.17(VDD_5) U5.30(VDD_12) U5.39(VDD_4) U5.52(VDD_6) U5.62(VDD_7) U5.72(VDD_1) U5.84(VDD_8) U5.95(VDD_9) U5.108(VDD_2) U5.121(VDD_10) U5.131(VDD_11) U5.144(VDD_SA) U6.2(VCC) U10.5 U11.5 U14.7(VDDIO1) U14.24(VDDIO2) UEXT.1 WKUP.P$1 ; supply symbol labelled 3.3V
VCC/2: C53.1 C54.1 C58.1(+) C71.2 FB2.2 LAN.3(COM) R43.2 R143.2 R144.2 R148.2 R149.2 U14.31(VDDRX) U14.38(VDDRCV) U14.42(VDDTX) ; supply symbol labelled 2.5V
VREF+: C30.2 R16.2 U5.32(VREF+)
Unconnected: RM3.4.1 RM3.4.2 U14.10(RXC) U14.11(RXER/ISO) U14.29(LED3/NWAYEN) U14.34(FXSD/FXEN) U14.45(XO)

## Notes on the sheet
- FSMC_A10 | FSMC_D2
- FSMC_A11 | FSMC_D3
- FSMC_A12
- FSMC_A13 | FSMC_CLK
- FSMC_A14 | FSMC_NOE
- FSMC_A15 | FSMC_NWE
- FSMC_INT2 | FSMC_NWAIT
- FSMC_NE1
- FSMC_D13
- FSMC_NE2/FSMC_NCE3 | FSMC_D14
- FSMC_NCE4_1/FSMC_NCE3 | FSMC_D15
- FSMC_NCE4_2 | FSMC_A16
- FSMC_A17
- FSMC_A18
- FSMC_D0
- FSMC_D1
- FSMC_A0 | FSMC_NBL0
- FSMC_A1 | FSMC_NBL1
- FSMC_A2 | FSMC_A23
- FSMC_A3 | FSMC_A19
- FSMC_A4 | FSMC_A20
- FSMC_A5 | FSMC_A21
- FSMC_NIORD | FSMC_A22
- FSMC_NREG | FSMC_D4
- FSMC_NIOWR | FSMC_D5
- FSMC_CD | FSMC_D6
- FSMC_INTR | FSMC_D7
- FSMC_D8
- FSMC_A6 | FSMC_D9
- FSMC_A7 | FSMC_D10
- FSMC_A8 | FSMC_D11
- FSMC_A9 | FSMC_D12
- SD/MMC CARD
- UEXT
- LAN
- BUTTON and LED
- JTAG
- USB_OTG1
- USB_OTG2
- 6-16VDC | POWER SUPPLY CIRCUIT
- USART3_TX
- USART3_RX
- GND

## Library data of the parts
3.3V_E AGND_E AREF_EN PE2_E PE4_E PE5_E PE6_E PE7_E PE9_E PE11_E PF6_E PF8_E PF10_E PG7_E PG8_E PG12_E PG15_E R-T = jumper:SJ: SMD solder JUMPER
3V_BAT = DOUBLE-SIDE:CON2: CONNECTORS - 2 PINS
B0_1/B0_0 B1_1/B1_0 = jumper:JP2E: JUMPER
C7 C13-C42 C45 C47-C57 C70-C80 = rcl:C-EU: CAPACITOR, European symbol
C43 C44 C46 C58 C59 C81 C82 C101 = rcl:CPOL-EU: POLARIZED CAPACITOR, European symbol
CD1 = gogo:6NC2_CLOCK_DRIVER
CON1 CON2 = Penko:CON6: CONNECTORS - 6 PINS
CON3 CON4 = Penko:CON8
D3 = semicon-smd-ipc:DIODE_AC-CA_: DUAL DIODE
D4 = OLIMEX_DISCRET:SMBJ15A
D5 D6 = OLIMEX_DISCRET:MMBZ5V6ALT1
FB2 FB3 L1 L4 L8 L9 = rcl:L-US: INDUCTOR, American symbol
FET1 = Penko:P-MOS+DIOD
GND_PIN = gogo:TESTPAD: drill 40mils, diameter 70mils
JTAG PD PE PF PG = con-harting-ml:ML20: HARTING
L5 L6 = OLIMEX_DISCRET:L
LAN = OLIMEX_CONNECTORS:RJLBC-060TC1
LED PWR_LED = DOUBLE-SIDE:LED
PWR_JACK = gogo:PWR-JAK
PWR_SEL = jumper:JP3Q: JUMPER
Q1 = crystal:HC49/S: CRYSTAL
Q2 = crystal:Q_GND
R1 R3 R5-R7 R9 R10 R12-R23 R27 R28 R30-R43 R48 R49 R55 R57-R59 R67 R85 R86 R138 R140-R150 = rcl:R-EU_: RESISTOR, European symbol
R11 R47 R50 R54 = OLIMEX_DISCRET:R_0R
RESET WKUP = gogo:SW-TAKT
RM1-RM3 RM5-RM7 = OLIMEX_DISCRET:R_MATRIX_4E
SD/MMC = OLIMEX_CONNECTORS:MICRO_SD/MMC
U3BOOT = Penko:CON3
U4 = OLIMEX_CASES:ARDUINO_SH_PLATFORM
U5 = OLIMEX_IC:STM32F207ZE: STM32F207ZE ARM-based 32-bit MCU, 150DMIPs, up to 1 MB Flash/128+4KB RAM,USB OTG HS/FS, Ethernet, 17 TIMs, 3 ADCs, 15 comm. interfaces & camera
U6 = gogo:RESET: Microcontroller Supervisory Circuit with Open Drain Output
U7 = OLIMEX_IC:SY8008
U8 = OLIMEX_IC:MP1482
U10 U11 = OLIMEX_IC:USBLC6-2
U12 = OLIMEX_IC:MIC2026: LM3526 Dual Port USB Power Switch and Over-Current Protection Features: -> Compatible with USB1.1 and USB2.0; -> 1 ms fault flag delay filters Hot-Plug events; -> Smooth turn-on eliminates in-rush induced voltage drop; -> UL recognized component: REF#205202; -> 1A nominal shortcircuit output current protects PC power supplies; -> Thermal shutdown protects device in direct short condition; -> 500mA minimum continuous load current; -> Small SO-8 package minimizes board space; -> 2.7V to 5.5V input voltage range; -> 140mOhm Max.switch resistance; -> 1 µA Max. standby current; -> 200µA Max. operating current; -> Under-voltage lockout(UVLO);
U14 = OLIMEX_IC:KS8721BL: Ethernet PHY
U$1 U$2 U$9 = SparkFunEagle-6-6-07:FIDUCIAL: Fiducial Alignment Points Various fiducial points for machine vision alignment.
UEXT = con-harting-ml:ML10: HARTING
USB_OTG1 USB_OTG2 = OLIMEX_CONNECTORS:MINI_USB9

## Net classes
1 PWR: width 0.203 mm, drill 0.076 mm, clearance 0.4 mm
2 thin: width 0.025 mm, drill 0.025 mm
3 gsm_pwr: width 0.914 mm, clearance 0.787 mm

## Board
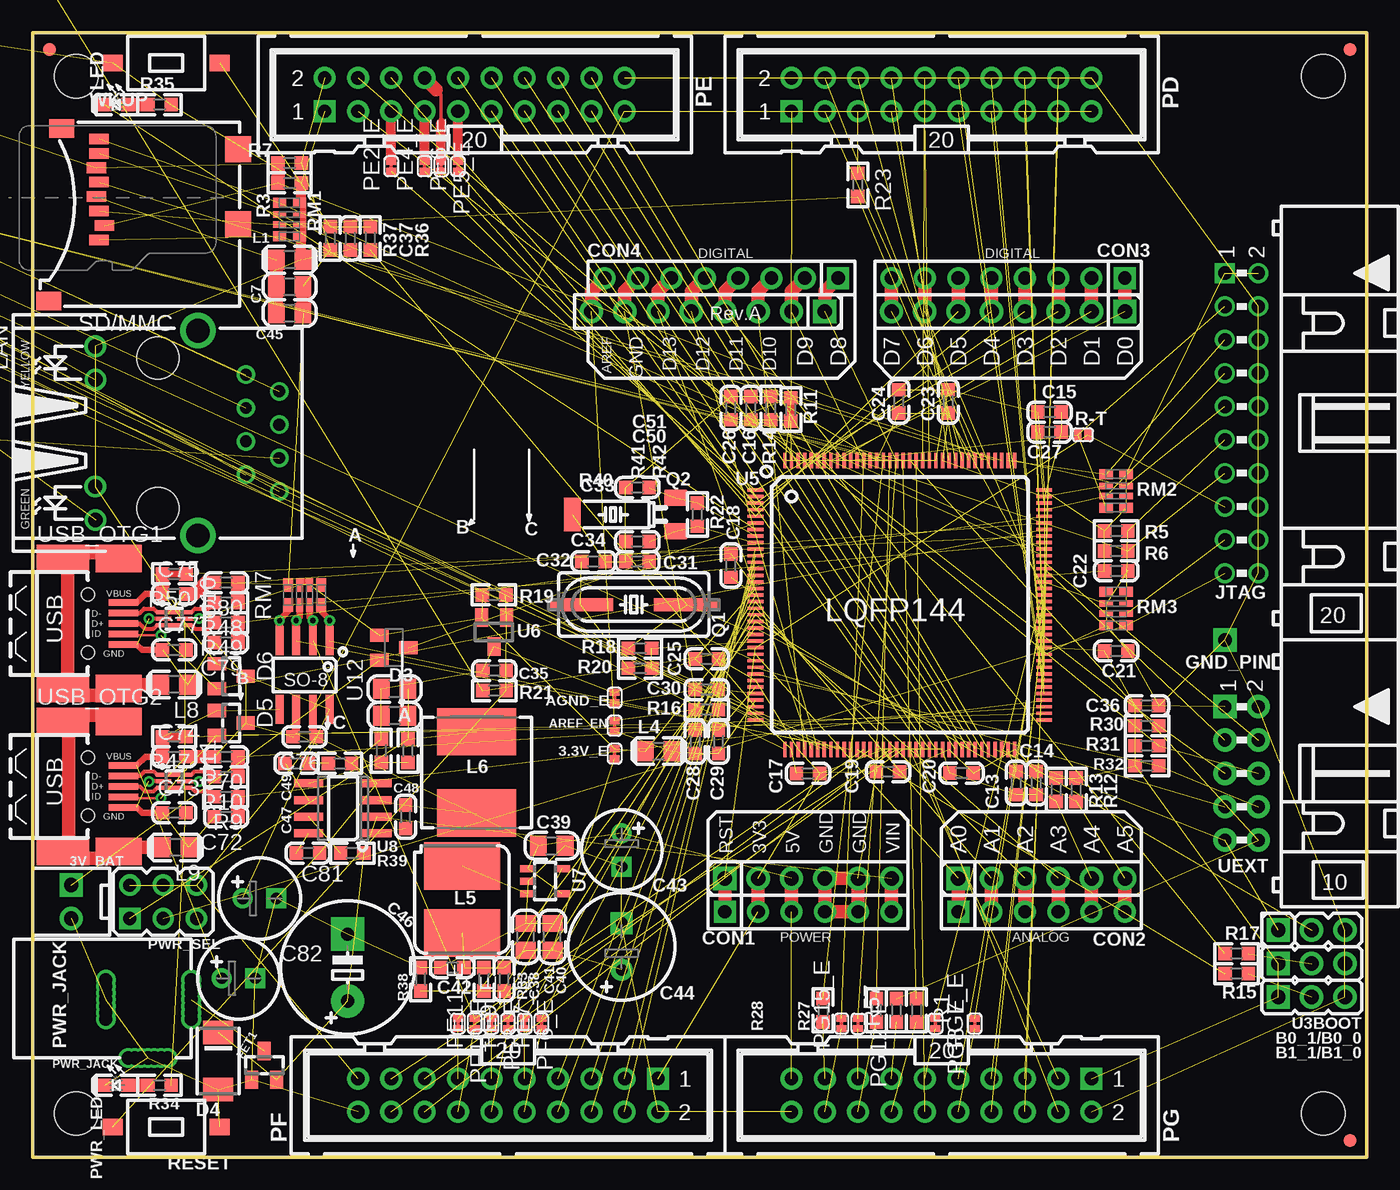
[diagram p2: board, top side]
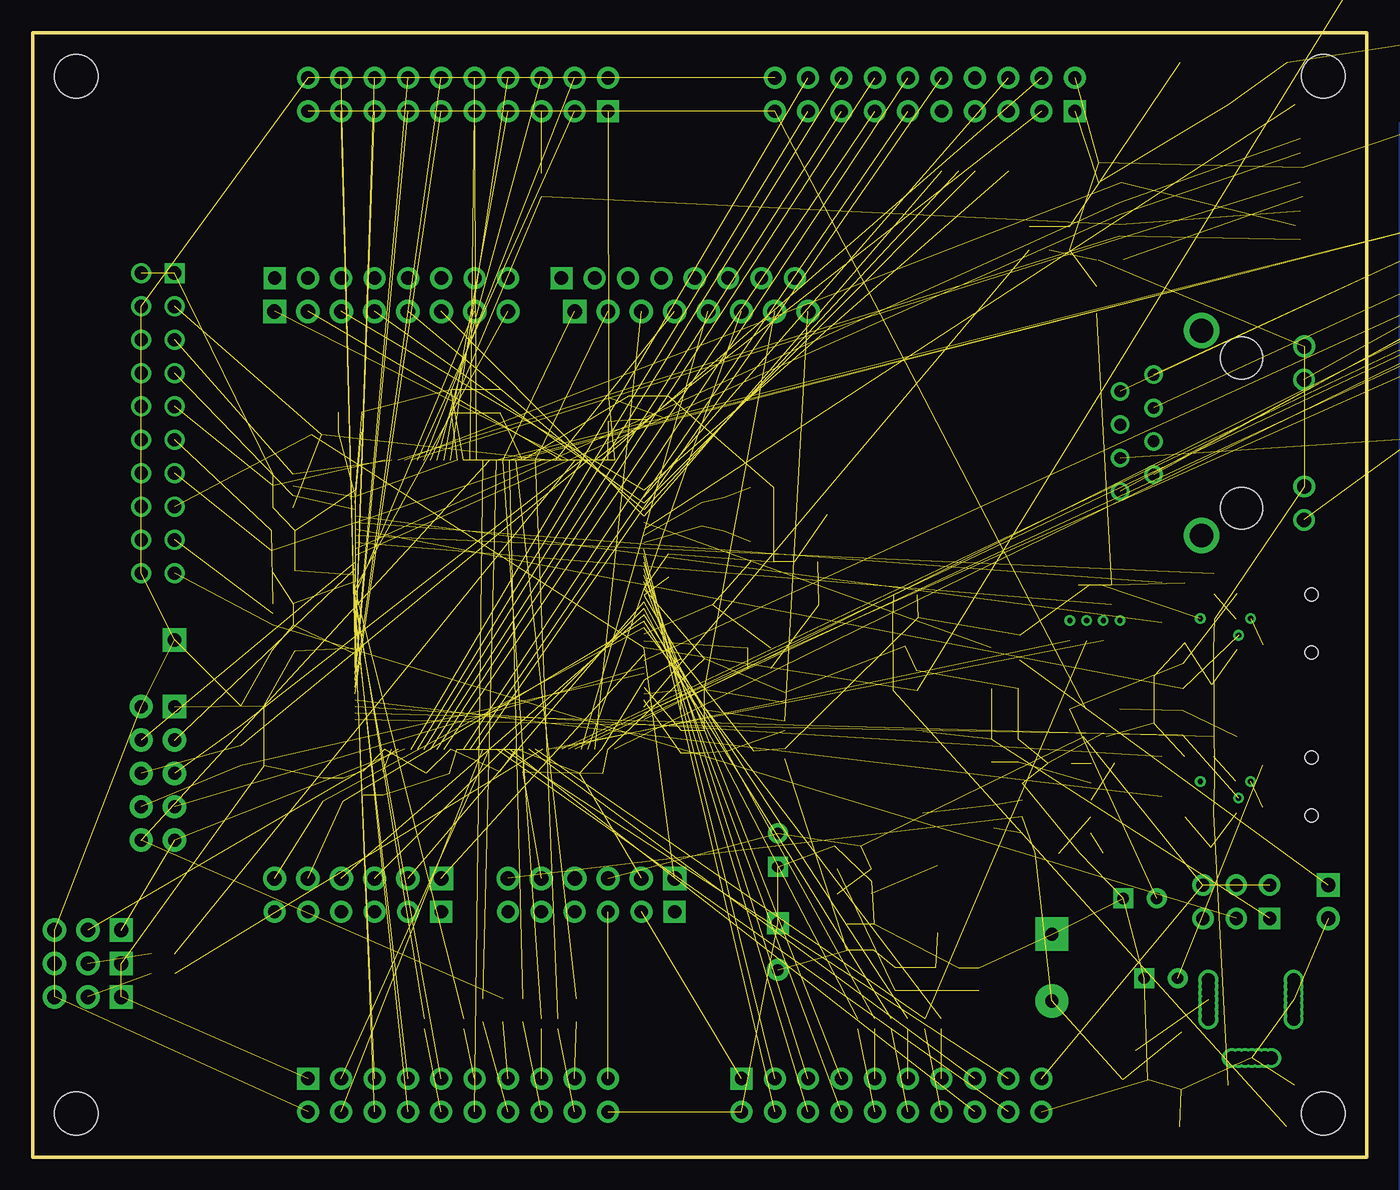
[diagram p3: board, bottom side, seen from below]

Size 101.6 x 85.6 mm. Coordinates in mm from the lower left corner, seen from the top.
Outline: 0,0 101.6,0 101.6,85.6 0,85.6 0,0
Copper layers (1+16): Top 0.035mm / dielectric 1.5mm / Bottom 0.035mm
Design rules "default": minimum track width 8mil, minimum drill 0.4mm, track to track 7.5mil, track to pad 7.5mil, pad to pad 7.5mil, via to via 7.5mil, smd to smd 1mil, copper to edge 10mil, drill to drill 8mil, minimum pad ring 10mil, minimum via ring 8mil, stop-mask expansion 4mil, vias tented up to drill 25mil, thermal gap 20mil
Holes 3.3 mm at 3.3,82.3 98.3,82.3 98.3,3.3 3.3,3.3

### Footprints (pad centres in the part's own frame; a part is rotated, then mirrored left to right if it is on the bottom)
SJ_1_SMALLER_CLOSE = smd 0.508 x 0.762: 1 -0.381,0; 2 0.381,0
CON2.54MM-2-0 = drill 1.092 pad 1.778 square: 1 -1.27,0 | drill 1.092 pad 1.778 round: 2 1.27,0
JP2 = drill 1.1 pad 1.778 square: 1 -2.54,0 | drill 1.1 pad 1.778 round: 2 0,0; 3 2.54,0
C0805_5MIL_DWS = smd 1.27 x 1.524: 1 -1.016,0; 2 1.016,0
C0603_DWS = smd 1.016 x 1.016: 1 -0.889,0; 2 0.889,0
E2,5-6 = drill 0.864 pad 1.524 round: + -1.27,0 | drill 0.864 pad 1.524 square: - 1.27,0
E3,5-8 = drill 0.864 pad 1.676 round: + -1.778,0 | drill 0.864 pad 1.676 square: - 1.778,0
E5-10,5 = drill 1.016 pad 2.54 round: + -2.54,0 | drill 1.016 pad 2.54 square: - 2.54,0
E2,5-6,3 = drill 0.864 pad 1.524 round: + -1.27,0 | drill 0.864 pad 1.524 square: - 1.27,0
7X5MM_CLOCK_DRIVER = smd 2 x 3: 1 -2.54,-1.941; 2 2.54,-1.941; 3 2.54,1.901; 4 -2.54,1.901
PN1X6 = drill 1.1 pad 1.778 square: 1 -6.35,0 | drill 1.1 pad 1.778 round: 2 -3.81,0; 3 -1.27,0; 4 1.27,0; 5 3.81,0; 6 6.35,0
PN1X8 = drill 1.1 pad 1.778 square: 1 -8.89,0 | drill 1.1 pad 1.778 round: 2 -6.35,0; 3 -3.81,0; 4 -1.27,0; 5 1.27,0; 6 3.81,0; 7 6.35,0; 8 8.89,0
SOT23C = smd 1 x 1.4: 1 -0.95,-1.1; 2 0.95,-1.1; 3 0,1.1
DO214AA = smd 1.778 x 2.286: A 2.177,0; C -2.177,0
SOT-23 = smd 1 x 1.4: 1 -0.95,-1.1; 2 0.95,-1.1; 3 0,1.1
L0805_5MIL_DWS = smd 1.27 x 1.524: 1 -1.016,0; 2 1.016,0
SOT23 = smd 1 x 1.4: 1 -0.95,-1.1; 2 0.95,-1.1; 3 0,1.1
TEST_PAD40/70/SQUARE = drill 1.016 pad 1.778 square: P$1 0,0
BH20R = drill 1.016 square: 1 -11.43,-1.27 | drill 1.016 round: 2 -11.43,1.27; 3 -8.89,-1.27; 4 -8.89,1.27; 5 -6.35,-1.27; 6 -6.35,1.27; 7 -3.81,-1.27; 8 -3.81,1.27; 9 -1.27,-1.27; 10 -1.27,1.27; 11 1.27,-1.27; 12 1.27,1.27; 13 3.81,-1.27; 14 3.81,1.27; 15 6.35,-1.27; 16 6.35,1.27; 17 8.89,-1.27; 18 8.89,1.27; 19 11.43,-1.27; 20 11.43,1.27
SD75 = smd 5.8 x 3.6: 1 0,2.55; 2 0,-2.55
8X8MM_3131 = smd 3.6 x 6: 1 -3.1,0; 2 3.1,0
RJLBC-060TC1 = drill 0.9 round: 1 -4.455,6.7; 2 -3.185,9.24; 3 -1.915,6.7; 4 -0.645,9.24; 5 0.625,6.7; 6 1.895,9.24; 7 3.165,6.7; 8 4.435,9.24 | drill 1.1 round: AG 4.07,-4.773; AY -6.61,-4.773; KG 6.61,-4.748; KY -4.07,-4.748 | drill 1.8 round: GND1 -7.8,3.05; GND2 7.8,3.05 | hole 3.2: -5.715,0; 5.715,0
LED-0603 = smd 1.016 x 1.016: A 0.889,0; C -0.889,0
ML20-MALE = drill 1.016 pad 1.676 square: 1 -11.43,-1.27 | drill 1.016 pad 1.676 round: 2 -11.43,1.27; 3 -8.89,-1.27; 4 -8.89,1.27; 5 -6.35,-1.27; 6 -6.35,1.27; 7 -3.81,-1.27; 8 -3.81,1.27; 9 -1.27,-1.27; 10 -1.27,1.27; 11 1.27,-1.27; 12 1.27,1.27; 13 3.81,-1.27; 14 3.81,1.27; 15 6.35,-1.27; 16 6.35,1.27; 17 8.89,-1.27; 18 8.89,1.27; 19 11.43,-1.27; 20 11.43,1.27
PWR_JACK_UNI_MILLING = drill 1 round: + 0,4.75; +1 0,5.25; +2 0,5.75; +3 0,6.25; +4 0,4.25; +5 0,3.75; +6 0,3.25; - -6.5,4.75; -1 -6.5,5.25; -2 -6.5,5.75; -3 -6.5,4.25; -4 -6.5,3.75; -5 -6.5,6.25; -6 -6.5,3.25; -- -3.3,0.3; --1 -3.8,0.3; --2 -4.3,0.3; --3 -4.8,0.3; --4 -2.8,0.3; --5 -2.3,0.3; --6 -1.8,0.3
JP3Q_NEW = drill 1 pad 1.626 square: 1 -2.54,-1.27 | drill 1 pad 1.626 round: 2 -2.54,1.27; 3 0,-1.27; 4 0,1.27; 5 2.54,-1.27; 6 2.54,1.27
HC49/SMD2_THIN = smd 5 x 1: 1 -4.064,0; 2 4.064,0
TC26H_3_REPAIR_SMD = smd 1.27 x 1.778: 1 -1.27,0; 2 1.27,0 | smd 2.54 x 1.27: GND 0,7.874
R0603_5MIL_DWS = smd 1.016 x 1.016: 1 -0.889,0; 2 0.889,0
R0603_5MIL_DWS_NA = smd 1.016 x 1.016: 1 -0.889,0; 2 0.889,0
0603_0R = smd 1.016 x 1.016: 1 -0.889,0; 2 0.889,0
SJ_1_SMALLER = smd 0.508 x 0.762: 1 -0.381,0; 2 0.381,0
SW-TAKT_6X3.5_SMD = smd 1.27 x 1.524: P$1 0,4.064; P$2 0,-4.064
R_MATRIX_4 = smd 1.016 x 0.762: 1.1 -0.762,1.27; 1.2 0.762,1.27; 4.1 -0.762,-1.27; 4.2 0.762,-1.27 | smd 1.016 x 0.508: 2.1 -0.762,0.381; 2.2 0.762,0.381; 3.1 -0.762,-0.381; 3.2 0.762,-0.381
TFR-MEM-CON = smd 0.8 x 1.5: 1 -3.2,10.7; 2 -2.1,10.3; 3 -1,10.7; 4 0.1,10.9; 5 1.2,10.7; 6 2.3,10.9; 7 3.4,10.7; 8 4.5,10.7 | smd 2 x 2: 9 3.7,0.1; 10 -2,0.1 | smd 1.4 x 1.9: 11 5.3,13.55; 12 -7.85,14.55
HN1X3 = drill 1.1 pad 1.778 square: 1 -2.54,0 | drill 1.1 pad 1.778 round: 2 0,0; 3 2.54,0
ARDUINO_SHIELD_PLATFORM_WITHOUT_DIMENSION = drill 1.016 pad 1.676 round: 3V3 22.86,2.54; 5V 25.4,2.54; A1 40.64,2.54; A2 43.18,2.54; A3 45.72,2.54; A4 48.26,2.54; A5 50.8,2.54; AREF 11.176,50.8; D1 48.26,50.8; D2 45.72,50.8; D3 43.18,50.8; D4 40.64,50.8; D5 38.1,50.8; D6 35.56,50.8; D7 33.02,50.8; D9 26.416,50.8; D10 23.876,50.8; D11 21.336,50.8; D12 18.796,50.8; D13 16.256,50.8; GND 27.94,2.54; GND@1 30.48,2.54; GND@2 13.716,50.8; VIN 33.02,2.54 | drill 1.016 pad 1.676 square: A0 38.1,2.54; D0 50.8,50.8; D8 28.956,50.8; RST 20.32,2.54
LQFP144 = smd 1.2 x 0.254: 1 -11,8.75; 2 -11,8.25; 3 -11,7.75; 4 -11,7.25; 5 -11,6.75; 6 -11,6.25; 7 -11,5.75; 8 -11,5.25; 9 -11,4.75; 10 -11,4.25; 11 -11,3.75; 12 -11,3.25; 13 -11,2.75; 14 -11,2.25; 15 -11,1.75; 16 -11,1.25; 17 -11,0.75; 18 -11,0.25; 19 -11,-0.25; 20 -11,-0.75; 21 -11,-1.25; 22 -11,-1.75; 23 -11,-2.25; 24 -11,-2.75; 25 -11,-3.25; 26 -11,-3.75; 27 -11,-4.25; 28 -11,-4.75; 29 -11,-5.25; 30 -11,-5.75; 31 -11,-6.25; 32 -11,-6.75; 33 -11,-7.25; 34 -11,-7.75; 35 -11,-8.25; 36 -11,-8.75; 73 11,-8.75; 74 11,-8.25; 75 11,-7.75; 76 11,-7.25; 77 11,-6.75; 78 11,-6.25; 79 11,-5.75; 80 11,-5.25; 81 11,-4.75; 82 11,-4.25; 83 11,-3.75; 84 11,-3.25; 85 11,-2.75; 86 11,-2.25; 87 11,-1.75; 88 11,-1.25; 89 11,-0.75; 90 11,-0.25; 91 11,0.25; 92 11,0.75; 93 11,1.25; 94 11,1.75; 95 11,2.25; 96 11,2.75; 97 11,3.25; 98 11,3.75; 99 11,4.25; 100 11,4.75; 101 11,5.25; 102 11,5.75; 103 11,6.25; 104 11,6.75; 105 11,7.25; 106 11,7.75; 107 11,8.25; 108 11,8.75 | smd 0.254 x 1.2: 37 -8.75,-11; 38 -8.25,-11; 39 -7.75,-11; 40 -7.25,-11; 41 -6.75,-11; 42 -6.25,-11; 43 -5.75,-11; 44 -5.25,-11; 45 -4.75,-11; 46 -4.25,-11; 47 -3.75,-11; 48 -3.25,-11; 49 -2.75,-11; 50 -2.25,-11; 51 -1.75,-11; 52 -1.25,-11; 53 -0.75,-11; 54 -0.25,-11; 55 0.25,-11; 56 0.75,-11; 57 1.25,-11; 58 1.75,-11; 59 2.25,-11; 60 2.75,-11; 61 3.25,-11; 62 3.75,-11; 63 4.25,-11; 64 4.75,-11; 65 5.25,-11; 66 5.75,-11; 67 6.25,-11; 68 6.75,-11; 69 7.25,-11; 70 7.75,-11; 71 8.25,-11; 72 8.75,-11; 109 8.75,11; 110 8.25,11; 111 7.75,11; 112 7.25,11; 113 6.75,11; 114 6.25,11; 115 5.75,11; 116 5.25,11; 117 4.75,11; 118 4.25,11; 119 3.75,11; 120 3.25,11; 121 2.75,11; 122 2.25,11; 123 1.75,11; 124 1.25,11; 125 0.75,11; 126 0.25,11; 127 -0.25,11; 128 -0.75,11; 129 -1.25,11; 130 -1.75,11; 131 -2.25,11; 132 -2.75,11; 133 -3.25,11; 134 -3.75,11; 135 -4.25,11; 136 -4.75,11; 137 -5.25,11; 138 -5.75,11; 139 -6.25,11; 140 -6.75,11; 141 -7.25,11; 142 -7.75,11; 143 -8.25,11; 144 -8.75,11
SOT23-5 = smd 0.55 x 1.2: 1 -0.95,-1.3; 2 0,-1.3; 3 0.95,-1.3; 4 0.95,1.3; 5 -0.95,1.3
SOIC8 = smd 0.6 x 2.2: 1 -1.905,-2.6; 2 -0.635,-2.6; 3 0.635,-2.6; 4 1.905,-2.6; 5 1.905,2.6; 6 0.635,2.6; 7 -0.635,2.6; 8 -1.905,2.6
USBLC6-2P6 = smd 0.3 x 1.46: 1 -0.5,-0.65; 3 0.5,-0.65; 4 0.5,0.65; 6 -0.5,0.65 | smd 0.3 x 1.16: 2 0,-0.8; 5 0,0.8
SO-8 = smd 0.6 x 2.2: 1 -1.905,-2.6; 2 -0.635,-2.6; 3 0.635,-2.6; 4 1.905,-2.6; 5 1.905,2.6; 6 0.635,2.6; 7 -0.635,2.6; 8 -1.905,2.6
LQFP48_MM = smd 1.624 x 0.254: 1 -4.25,2.75; 2 -4.25,2.25; 3 -4.25,1.75; 4 -4.25,1.25; 5 -4.25,0.75; 6 -4.25,0.25; 7 -4.25,-0.25; 8 -4.25,-0.75; 9 -4.25,-1.25; 10 -4.25,-1.75; 11 -4.25,-2.25; 12 -4.25,-2.75; 25 4.25,-2.75; 26 4.25,-2.25; 27 4.25,-1.75; 28 4.25,-1.25; 29 4.25,-0.75; 30 4.25,-0.25; 31 4.25,0.25; 32 4.25,0.75; 33 4.25,1.25; 34 4.25,1.75; 35 4.25,2.25; 36 4.25,2.75 | smd 0.254 x 1.624: 13 -2.75,-4.25; 14 -2.25,-4.25; 15 -1.75,-4.25; 16 -1.25,-4.25; 17 -0.75,-4.25; 18 -0.25,-4.25; 19 0.25,-4.25; 20 0.75,-4.25; 21 1.25,-4.25; 22 1.75,-4.25; 23 2.25,-4.25; 24 2.75,-4.25; 37 2.75,4.25; 38 2.25,4.25; 39 1.75,4.25; 40 1.25,4.25; 41 0.75,4.25; 42 0.25,4.25; 43 -0.25,4.25; 44 -0.75,4.25; 45 -1.25,4.25; 46 -1.75,4.25; 47 -2.25,4.25; 48 -2.75,4.25
FIDUCIAL-1X2 = smd 1 x 1: 1 0,0
BH10R = drill 1 pad 1.778 square: 1 -5.08,-1.27 | drill 1 pad 1.778 round: 2 -5.08,1.27; 3 -2.54,-1.27; 4 -2.54,1.27; 5 0,-1.27; 6 0,1.27; 7 2.54,-1.27; 8 2.54,1.27; 9 5.08,-1.27; 10 5.08,1.27
USB_MINI_9PIN = smd 2.25 x 0.5: D+ 2.706,0; D- 2.706,0.8; GND 2.706,-1.6; ID 2.706,-0.8; VBUS 2.706,1.6 | smd 4 x 2.1: GND1 -1.9,4.95; GND3 -1.9,-4.95 | smd 3.5 x 2.1: GND2 2.35,4.95; GND4 2.35,-4.95 | hole 1: 0,2.2; 0,-2.2

### Placement (x,y rotation side)
3.3V_E  44.32,30.71 90 top
3V_BAT  2.92,19.43 270 top
AGND_E  44.32,34.98 90 top
AREF_EN  44.32,32.84 90 top
B0_1/B0_0  97.41,14.73 0 top
B1_1/B1_0  97.41,12.19 0 top
C7  19.56,66.29 0 top
C13  74.9,28.47 90 top
C14  76.43,28.47 90 top
C15  77.44,56.72 180 top
C16  54.69,57.02 270 top
C17  59.05,29.21 0 top
C18  53.16,45.03 270 top
C19  65.15,29.34 0 top
C20  70.74,29.24 0 top
C21  82.52,38.53 180 top
C22  82.52,44.63 180 top
C23  69.72,57.53 90 top
C24  65.96,57.53 90 top
C25  51.33,37.92 0 top
C26  53.16,57.02 270 top
C27  77.44,55.19 180 top
C28  50.44,31.62 90 top
C29  52.22,31.62 270 top
C30  51.33,35.59 0 top
C31  46.05,45.34 180 top
C32  42.7,45.34 0 top
C33  46.05,50.98 180 top
C34  46.05,46.86 180 top
C35  35.15,37.03 0 top
C36  84.86,34.37 180 top
C37  24.18,69.95 270 top
C38  35.89,13.54 270 top
C39  39.52,23.7 0 top
C40  39.57,16.76 90 top
C41  37.54,16.76 90 top
C42  31.95,14.43 180 top
C43  44.86,23.37 270 top
C44  44.86,16.03 90 top
C45  19.56,64.26 0 top
C46  23.98,14.43 90 top
C47  20.95,23.14 0 top
C48  28.4,25.91 90 top
C49  20.09,29.97 0 top
C50  27.56,33.6 180 top
C51  27.56,35.64 180 top
C52  -66.67,85.6 180 top  (outside the outline)
C53  -59.05,55.75 0 top  (outside the outline)
C54  -59.05,60.83 0 top  (outside the outline)
C55  -59.05,58.29 0 top  (outside the outline)
C56  -59.69,78.61 270 top  (outside the outline)
C57  -51.44,78.61 90 top  (outside the outline)
C58  -50.16,98.3 270 top  (outside the outline)
C59  -62.23,78.61 270 top  (outside the outline)
C70  14.73,30.48 180 top
C71  -52.7,98.3 270 top  (outside the outline)
C72  14.73,25.91 180 top
C73  10.77,26.21 0 top
C74  10.77,30.48 0 top
C75  10.77,42.88 0 top
C76  20.7,32 180 top
C77  10.77,38.61 0 top
C78  -60.96,98.3 270 top  (outside the outline)
C79  14.73,39.17 180 top
C80  14.73,43.74 180 top
C81  17.27,19.68 0 top
C82  15.67,13.61 0 top
C101  -62.87,98.3 90 top  (outside the outline)
CD1  -55.78,112.42 0 top  (outside the outline)
CON1  59.05,21.21 0 top
CON2  76.83,21.21 0 top
CON3  74.3,64.39 180 top
CON4  51.44,64.39 180 top
D3  27.51,38.79 270 top
D4  14.12,7.32 270 top
D5  15.11,33.05 270 top
D6  15.11,36.6 270 top
FB2  -57.15,98.3 90 top  (outside the outline)
FB3  -64.77,78.61 90 top  (outside the outline)
FET1  17.63,6.99 0 top
GND_PIN  90.81,39.37 0 top
JTAG  92.08,55.88 270 top
L1  19.56,68.33 180 top
L4  47.68,30.91 0 top
L5  32.69,19.61 0 top
L6  33.81,29.29 90 top
L8  10.77,35.97 180 top
L9  10.87,23.57 180 top
LAN  9.53,55.12 270 top
LED  6.35,80.14 0 top
PD  69.22,80.9 0 top
PE  33.66,80.9 0 top
PE2_E  27.3,75.44 90 top
PE4_E  29.84,75.44 90 top
PE5_E  31.11,75.44 270 top
PE6_E  32.38,75.44 90 top
PE7_E  38.73,10.16 90 top
PE9_E  36.2,10.16 90 top
PE11_E  33.66,10.16 90 top
PF  36.2,4.7 180 top
PF6_E  37.47,10.16 270 top
PF8_E  34.92,10.16 270 top
PF10_E  32.38,10.16 270 top
PG  69.22,4.7 180 top
PG7_E  71.75,10.16 90 top
PG8_E  68.76,10.16 270 top
PG12_E  62.87,10.16 270 top
PG15_E  61.59,10.16 90 top
PWR_JACK  12.06,7.24 0 top
PWR_LED  6.35,5.46 0 top
PWR_SEL  9.93,19.43 0 top
Q1  45.77,42.06 0 top
Q2  48.97,48.92 90 top
R1  67.31,11.18 270 top
R3  19.56,74.17 180 top
R5  82.52,47.68 180 top
R6  82.52,46.15 180 top
R7  19.56,75.69 0 top
R9  14.73,27.43 180 top
R10  14.73,28.96 180 top
R11  57.73,56.92 90 top
R12  79.48,27.97 90 top
R13  77.95,27.97 90 top
R14  56.21,57.02 90 top
R15  91.69,13.97 0 top
R16  51.33,34.06 0 top
R17  91.69,15.49 0 top
R18  46.25,38.73 180 top
R19  35.13,42.8 180 top
R20  46.25,37.21 0 top
R21  35.15,35.51 0 top
R22  50.62,48.92 90 top
R23  62.84,74.02 270 top
R27  64.26,11.18 270 top
R28  60.2,11.18 90 top
R30  84.86,32.84 180 top
R31  84.86,31.32 180 top
R32  84.86,29.79 180 top
R33  34.37,13.54 270 top
R34  9.65,5.46 180 top
R35  9.65,80.14 0 top
R36  25.7,69.95 270 top
R37  22.66,69.95 90 top
R38  29.54,13.54 90 top
R39  24.33,23.14 180 top
R40  23.39,29.97 0 top
R41  26.54,30.94 90 top
R42  28.57,30.94 90 top
R43  -62.87,55.75 0 top  (outside the outline)
R47  10.77,32 180 top
R48  14.73,42.21 180 top
R49  14.73,40.69 180 top
R50  10.77,44.4 180 top
R54  -21.87,125.2 0 top  (outside the outline)
R55  -59.05,98.3 270 top  (outside the outline)
R57  65.79,11.18 90 top
R58  -55.24,98.3 270 top  (outside the outline)
R59  -46.99,81.79 180 top  (outside the outline)
R67  -46.99,83.69 180 top  (outside the outline)
R85  -38.05,113.92 0 top  (outside the outline)
R86  -66.67,91.95 180 top  (outside the outline)
R138  -53.34,78.61 270 top  (outside the outline)
R140  -66.67,93.85 0 top  (outside the outline)
R141  -46.99,91.31 180 top  (outside the outline)
R142  -46.99,93.22 180 top  (outside the outline)
R143  -62.87,65.91 0 top  (outside the outline)
R144  -62.87,63.37 0 top  (outside the outline)
R145  -46.99,95.12 180 top  (outside the outline)
R146  -46.99,89.41 180 top  (outside the outline)
R147  -46.99,87.5 180 top  (outside the outline)
R148  -62.87,60.83 0 top  (outside the outline)
R149  -62.87,58.29 0 top  (outside the outline)
R150  -46.99,85.6 180 top  (outside the outline)
R-T  79.98,54.99 0 top
RESET  10.16,2.29 90 top
RM1  19.56,71.37 0 top
RM2  82.52,50.72 0 top
RM3  82.52,41.76 180 top
RM5  -66.67,88.77 180 top  (outside the outline)
RM6  -56.52,78.61 90 top  (outside the outline)
RM7  20.7,42.8 90 top
SD/MMC  15.75,73.03 90 top
U3BOOT  97.41,17.27 0 top
U4  32.38,16.13 0 top
U5  66.04,42.04 0 top
U6  35.13,39.98 180 top
U7  39.01,21.01 270 top
U8  23.62,26.54 90 top
U10  10.77,41 270 top
U11  10.77,28.6 270 top
U12  20.7,36.7 180 top
U14  -56.77,88.57 0 top  (outside the outline)
U$1  1.27,84.33 0 top
U$2  100.33,84.33 0 top
U$4  [OLIMEX1_V]  -70.99,-0.89 0 bottom  (outside the outline)
U$5  [ESD_SYMBOL]  -64.77,6.1 0 bottom  (outside the outline)
U$6  [PB]  -56.16,9.6 0 bottom  (outside the outline)
U$7  [OLIMEX1_V]  -29.01,62.23 0 top  (outside the outline)
U$8  [RECYCLE_BIN1/8]  -42.55,-0.38 0 bottom  (outside the outline)
U$9  100.33,1.27 0 top
U$15  [ROHS]  -54.1,16.15 0 bottom  (outside the outline)
U$16  [ATTENTION_SMALL]  -43.43,12.06 0 bottom  (outside the outline)
UEXT  92.08,29.21 270 top
USB_OTG1  4.19,40.61 0 top
USB_OTG2  4.19,28.22 0 top
WKUP  10.16,83.31 90 top

### Tracks (layer width: path | path; a pad name or v marks a point on that pad's centre or on a via)
+5V  (12 unrouted)
  Top 0.61: U12.7 21.34,32.26 C76.1
  Top 1.016: U4.5V CON1.3
+5V_EXT  (4 unrouted)
+5V_HOST_PWR  (3 unrouted)
  Top 0.508: USB_OTG1.VBUS 7.92,42.22 8.59,42.88 C75.1
  Top 1.016: C75.1 R50.2
+5V_JTAG  (2 unrouted)
+5V_OTG_PWR  (3 unrouted)
  Top 0.508: USB_OTG2.VBUS 7.92,29.82 8.59,30.48 C74.1
  Top 1.016: C74.1 R47.2
+7V  (4 unrouted)
+15V  (5 unrouted)
  Top 1.016: U4.VIN CON1.6
AGND  (5 unrouted)
  Top 1.016: U4.GND@2 45.09,65.91 CON4.7
AREF  (2 unrouted)
  Top 1.016: U4.AREF 42.55,65.91 CON4.8
BOOT0  (1 unrouted)
GND  (via drill 0.4)  (133 unrouted)
  Top 0.305: U10.2 v8.84,41 | U11.2 v8.84,28.6
  Top 0.508: USB_OTG2.GND 7.92,26.62 8.33,26.21 C73.1 | USB_OTG1.GND 7.92,39.02 8.33,38.61 C77.1
  Top 0.61: U12.6 20.07,32.26 C76.2
  Top 1.016: C75.2 12.32,42.88 13.18,43.74 C80.2 | C74.2 C70.2 | C45.2 C7.2 | U4.GND CON1.4 CON1.5 U4.GND@1 U4.GND
  pour Bottom (isolate 0.406, rank 4): -2.54,78.74 -7.62,78.74 -7.62,-2.54 -2.54,-2.54
  pour Top (isolate 0.406, rank 4): -5.08,81.28 -10.16,81.28 -10.16,-5.08 -5.08,-5.08
LED  (1 unrouted)
LED100/DUP  (2 unrouted)
LEDACT  (1 unrouted)
N$1  (3 unrouted)
N$2  (2 unrouted)
N$3  (2 unrouted)
N$4  (1 unrouted)
N$5
  Top 1.016: LED.A R35.1
N$6  (1 unrouted)
N$7  (1 unrouted)
N$8  (3 unrouted)
N$9  (1 unrouted)
N$10  (7 unrouted)
N$11  (3 unrouted)
N$12  (1 unrouted)
N$13  (1 unrouted)
N$14  (1 unrouted)
N$15  (1 unrouted)
N$16  (1 unrouted)
N$17  (1 unrouted)
N$18  (1 unrouted)
N$19  (1 unrouted)
N$21  (2 unrouted)
N$22  (2 unrouted)
N$24  (1 unrouted)
N$25  (3 unrouted)
N$26
  Top 0.254: 30.73,81.28 31.11,80.9 31.11,78.74
  Top 0.508: PE5_E.1 31.11,75.95
  Top 0.762: 31.11,75.95 31.11,78.74
  Top 1.016: PE.8 30.73,81.28
N$27
  Top 0.508: PE6_E.2 32.38,75.95
  Top 0.762: 32.38,75.95 PE.9
N$28
  Top 0.508: PE4_E.2 29.84,75.95
  Top 0.762: 29.84,75.95 PE.7
N$29  (1 unrouted)
N$30
  Top 0.508: PE2_E.2 27.3,75.95
  Top 0.762: 27.3,75.95 PE.5
N$31  (1 unrouted)
N$32  (1 unrouted)
N$33  (2 unrouted)
N$34  (1 unrouted)
N$35  (1 unrouted)
N$36  (1 unrouted)
N$37  (1 unrouted)
N$38  (1 unrouted)
N$39  (1 unrouted)
N$40  (1 unrouted)
N$43
  Top 0.305: U11.4 12.08,28.1 12.34,27.84 13.44,27.84 R9.2
N$45  (1 unrouted)
N$46  (1 unrouted)
N$47
  Top 0.305: U11.6 12.08,29.1 12.34,29.36 13.41,29.36 13.82,28.96 R10.2
N$48  (1 unrouted)
N$50  (2 unrouted)
N$51
  Top 0.305: U10.6 12.08,41.5 12.34,41.76 13.39,41.76 R48.2
N$52
  Top 0.305: U10.4 12.08,40.5 12.34,40.23 13.39,40.23 R49.2
N$60  (1 unrouted)
N$61  (1 unrouted)
N$62  (2 unrouted)
N$64  (1 unrouted)
N$68  (1 unrouted)
N$71  (1 unrouted)
N$75  (1 unrouted)
N$78  (1 unrouted)
  Top 1.016: C45.1 C7.1 L1.2
N$79  (2 unrouted)
N$82  (2 unrouted)
N$85  (2 unrouted)
N$98  (1 unrouted)
N$114  (1 unrouted)
N$115  (1 unrouted)
N$116  (1 unrouted)
N$117  (1 unrouted)
N$119  (1 unrouted)
N$120  (1 unrouted)
N$121  (1 unrouted)
N$122  (1 unrouted)
N$123  (1 unrouted)
N$125  (1 unrouted)
N$128  (1 unrouted)
N$129
  Top 1.016: PWR_LED.A R34.2
N$163  (4 unrouted)
N$470  (3 unrouted)
PA0/WKUP  (1 unrouted)
PA1/D8/ETH_RMII_REF_CLK  (2 unrouted)
PA2/ETH_RMII_MDIO  (2 unrouted)
PA3/ETH_RMII_MDINT  (2 unrouted)
PA4/D10/SPI1_NSS  (1 unrouted)
  Top 1.016: U4.D10 55.24,65.91 CON4.3
PA5/D13/SPI1_SCK  (1 unrouted)
  Top 1.016: U4.D13 47.62,65.91 CON4.6
PA6/D12/SPI1_MISO  (1 unrouted)
  Top 1.016: U4.D12 50.16,65.91 CON4.5
PA7/D11/ETH_RMII_CRS_DV  (2 unrouted)
PA8/USB_HS_VBUSON  (via drill 0.4)  (1 unrouted)
  Top 0.508: v18.8,40.84 18.8,40.92 19.43,41.55 RM7.1.1
  Top 0.61: U12.4 v18.8,40.84
PA9/OTG_FS_VBUS  (1 unrouted)
PA10/OTG_FS_ID  (via drill 0.4)  (2 unrouted)
  Top 0.203: USB_OTG1.ID 6.99,39.73 v9.75,39.73
PA11/OTG_FS_DM  (1 unrouted)
  Top 1.016: R48.1 C80.1
PA12/OTG_FS_DP  (1 unrouted)
  Top 1.016: C79.1 R49.1
PA13/TMS  (2 unrouted)
PA14/TCK  (2 unrouted)
PA15/TDI  (2 unrouted)
PB0/USB_FS_VBUSON  (via drill 0.4)  (1 unrouted)
  Top 0.508: v22.61,40.84 22.61,40.92 21.97,41.55 RM7.4.1
  Top 0.61: U12.1 v22.61,40.84
PB1/USB_HS_FAULT  (via drill 0.4)  (1 unrouted)
  Top 0.508: RM7.2.1 20.32,41.1 v20.07,40.84
  Top 0.61: U12.3 v20.07,40.84
PB2  (1 unrouted)
PB3/TDO  (2 unrouted)
PB4/TRST  (3 unrouted)
PB5/D11/SPI1_MOSI  (1 unrouted)
  Top 1.016: U4.D11 52.7,65.91 CON4.4
PB6/D1/USART1_TX  (1 unrouted)
  Top 1.016: CON3.2 U4.D1
PB8/I2C1_SCL  (2 unrouted)
PB9/I2C1_SDA  (2 unrouted)
PB10/SPI2_SCK/UART3_TX  (2 unrouted)
PB12/OTG_HS_ID  (via drill 0.4)  (2 unrouted)
  Top 0.203: USB_OTG2.ID 6.99,27.33 v9.75,27.33
PB13/OTG_HS_VBUS  (1 unrouted)
PB14/OTG_HS_DM  (1 unrouted)
  Top 1.016: R10.1 C70.1
PB15/OTG_HS_DP  (1 unrouted)
  Top 1.016: C72.1 R9.1
PC0/A0  (1 unrouted)
  Top 1.016: U4.A0 CON2.1
PC1/ETH_RMII_MDC  (1 unrouted)
PC2/SPI2_MISO  (1 unrouted)
PC3/SPI2_MOSI  (2 unrouted)
PC4/ETH_RMII_RXD0  (2 unrouted)
PC5/ETH_RMII_RXD1  (2 unrouted)
PC6/USART6_TX  (1 unrouted)
PC7/USART6_RX  (1 unrouted)
PC8/SD_D0  (2 unrouted)
PC9/SD_D1  (2 unrouted)
PC10/SD_D2  (2 unrouted)
PC11/SD_D3  (2 unrouted)
  Top 1.016: R7.1 R3.2
PC12/SD_CLK  (1 unrouted)
PC14  (3 unrouted)
PC15  (3 unrouted)
PD0  (1 unrouted)
PD1  (1 unrouted)
PD2/SD_CMD  (3 unrouted)
PD3  (1 unrouted)
PD4  (1 unrouted)
PD5  (1 unrouted)
PD6  (1 unrouted)
PD7  (1 unrouted)
PD8  (1 unrouted)
PD9  (1 unrouted)
PD10  (1 unrouted)
PD11  (1 unrouted)
PD12  (1 unrouted)
PD13  (1 unrouted)
PD14  (1 unrouted)
PD15  (1 unrouted)
PE0  (1 unrouted)
PE1  (1 unrouted)
PE2/D2  (2 unrouted)
  Top 1.016: CON3.3 U4.D2
PE3  (1 unrouted)
PE4/D3  (2 unrouted)
  Top 1.016: CON3.4 U4.D3
PE5/D4  (2 unrouted)
  Top 1.016: CON3.5 U4.D4
PE6/D5  (2 unrouted)
  Top 1.016: CON3.6 U4.D5
PE7  (1 unrouted)
PE8  (1 unrouted)
PE9  (1 unrouted)
PE10  (1 unrouted)
PE11  (1 unrouted)
PE12  (1 unrouted)
PE13  (1 unrouted)
PE14  (1 unrouted)
PE15  (1 unrouted)
PF0  (1 unrouted)
PF1  (1 unrouted)
PF2  (1 unrouted)
PF3  (1 unrouted)
PF4  (1 unrouted)
PF5  (1 unrouted)
PF6/A1  (2 unrouted)
  Top 1.016: U4.A1 CON2.2
PF7/A2  (2 unrouted)
  Top 1.016: U4.A2 CON2.3
PF9/A4  (3 unrouted)
  Top 1.016: U4.A4 CON2.5
PF10/A5  (3 unrouted)
  Top 1.016: U4.A5 CON2.6
PF11/USB_FS_FAULT  (via drill 0.4)  (2 unrouted)
  Top 0.508: RM7.3.1 21.08,41.1 v21.34,40.84
  Top 0.61: U12.2 v21.34,40.84
PF12  (1 unrouted)
PF13  (1 unrouted)
PF14  (1 unrouted)
PF15  (1 unrouted)
PG0  (1 unrouted)
PG1  (1 unrouted)
PG2  (1 unrouted)
PG3  (1 unrouted)
PG4  (1 unrouted)
PG5  (1 unrouted)
PG6  (1 unrouted)
PG7/D6  (2 unrouted)
  Top 1.016: CON3.7 U4.D6
PG8/D7  (2 unrouted)
  Top 1.016: CON3.8 U4.D7
PG9  (1 unrouted)
PG10/UEXT_CS  (2 unrouted)
PG11/ETH_RMII_TX_EN  (2 unrouted)
PG12/D8  (2 unrouted)
  Top 1.016: U4.D8 60.33,65.91 CON4.1
PG13/ETH_RMII_TXD0  (2 unrouted)
PG14/ETH_RMII_TXD1  (2 unrouted)
PG15/D9  (2 unrouted)
  Top 1.016: U4.D9 57.78,65.91 CON4.2
PHY_RSTN  (2 unrouted)
PHY_VDD_PLL  (4 unrouted)
RB7/D0/USART1_RX  (1 unrouted)
  Top 1.016: CON3.1 U4.D0
RB11/UART3_RX  (1 unrouted)
RF8/A3  (2 unrouted)
  Top 1.016: U4.A3 CON2.4
RST  (5 unrouted)
  Top 1.016: U4.RST CON1.1
USB_HOST_D+
  Top 0.305: USB_OTG1.D+ 8.13,40.62 8.51,40.23 9.2,40.23 9.46,40.5 U10.3
USB_HOST_D-
  Top 0.305: USB_OTG1.D- 8.14,41.41 8.48,41.76 9.2,41.76 9.46,41.5 U10.1
USB_OTG_D+
  Top 0.305: USB_OTG2.D+ 8.15,28.22 8.53,27.84 9.2,27.84 9.46,28.1 U11.3
USB_OTG_D-
  Top 0.305: USB_OTG2.D- 8.17,29.02 8.51,29.36 9.2,29.36 9.46,29.1 U11.1
USB_SHIELD1
  Top 1.016: USB_OTG2.GND2 6.54,33.63 2.74,33.63 | USB_OTG2.GND1 2.29,33.63 2.74,33.63 | USB_OTG2.GND3 2.74,23.27 | 2.74,23.27 2.74,33.63 | 2.74,23.27 2.74,22.76 6.54,22.76 USB_OTG2.GND4 6.54,23.57 L9.2
USB_SHIELD2
  Top 1.016: USB_OTG1.GND2 6.54,46.02 2.64,46.02 | USB_OTG1.GND1 2.29,46.02 2.64,46.02 | USB_OTG1.GND3 2.64,35.66 | 2.64,35.66 2.64,46.02 | 2.64,35.66 2.64,35.15 6.54,35.15 USB_OTG1.GND4 6.54,35.97 L8.2
VBAT  (1 unrouted)
VCC  (via drill 0.4)  (74 unrouted)
  Top 0.305: U10.5 v12.68,41 | U11.5 v12.68,28.6
  Top 0.508: RM7.3.2 21.08,43.81 20.32,43.81 RM7.2.2 | 20.57,71.75 20.57,72.64 RM1.1.2 | 20.57,70.99 20.57,71.75 | 20.57,71.75 RM1.2.2 | RM1.4.2 20.57,70.1 20.57,70.99 | 20.57,70.99 RM1.3.2
  Top 0.762: R3.1 20.45,72.64 RM1.1.2 | RM1.4.2 20.45,70.1 20.45,68.33 L1.1
  Top 1.016: U4.3V3 CON1.2
VCC/2  (13 unrouted)
VREF+  (2 unrouted)

### Text on the board
tPlace: Fix na U8 v/u R48
tNames: STM32-H407 | Rev.A | A | B | C | B | C | A | + | + | + | + | +
bNames: PWR_SEL | 1-2 +5V_EXT | 3-4 +5V_JTAG | 5-6 +5V_OTG_PWR | + | 6-16VDC | BOOT MODE | B0_1/B0_0 | B1_1/B1_0 | - | User Flash Memory | X | System Memory | Embedded SRAM | 2 | 4 | 6 | DESCRIPTION | STATE | JUMPER | 1 | 3 | 5 | RST and TRST are separated | R-T | RST and TRST are connected | Board digital power supply is disabled | 3.3V_E | Board digital power supply is enabled | WWW.OLIMEX.COM/DEV | Analog ground is disabled | AGND_E | Analog ground is enabled (default) | ADC reference is disabled | AREF_EN | ADC reference is enabled (default)